# EAGLE design guhPLC_V0.2 (EAGLE 6.1)
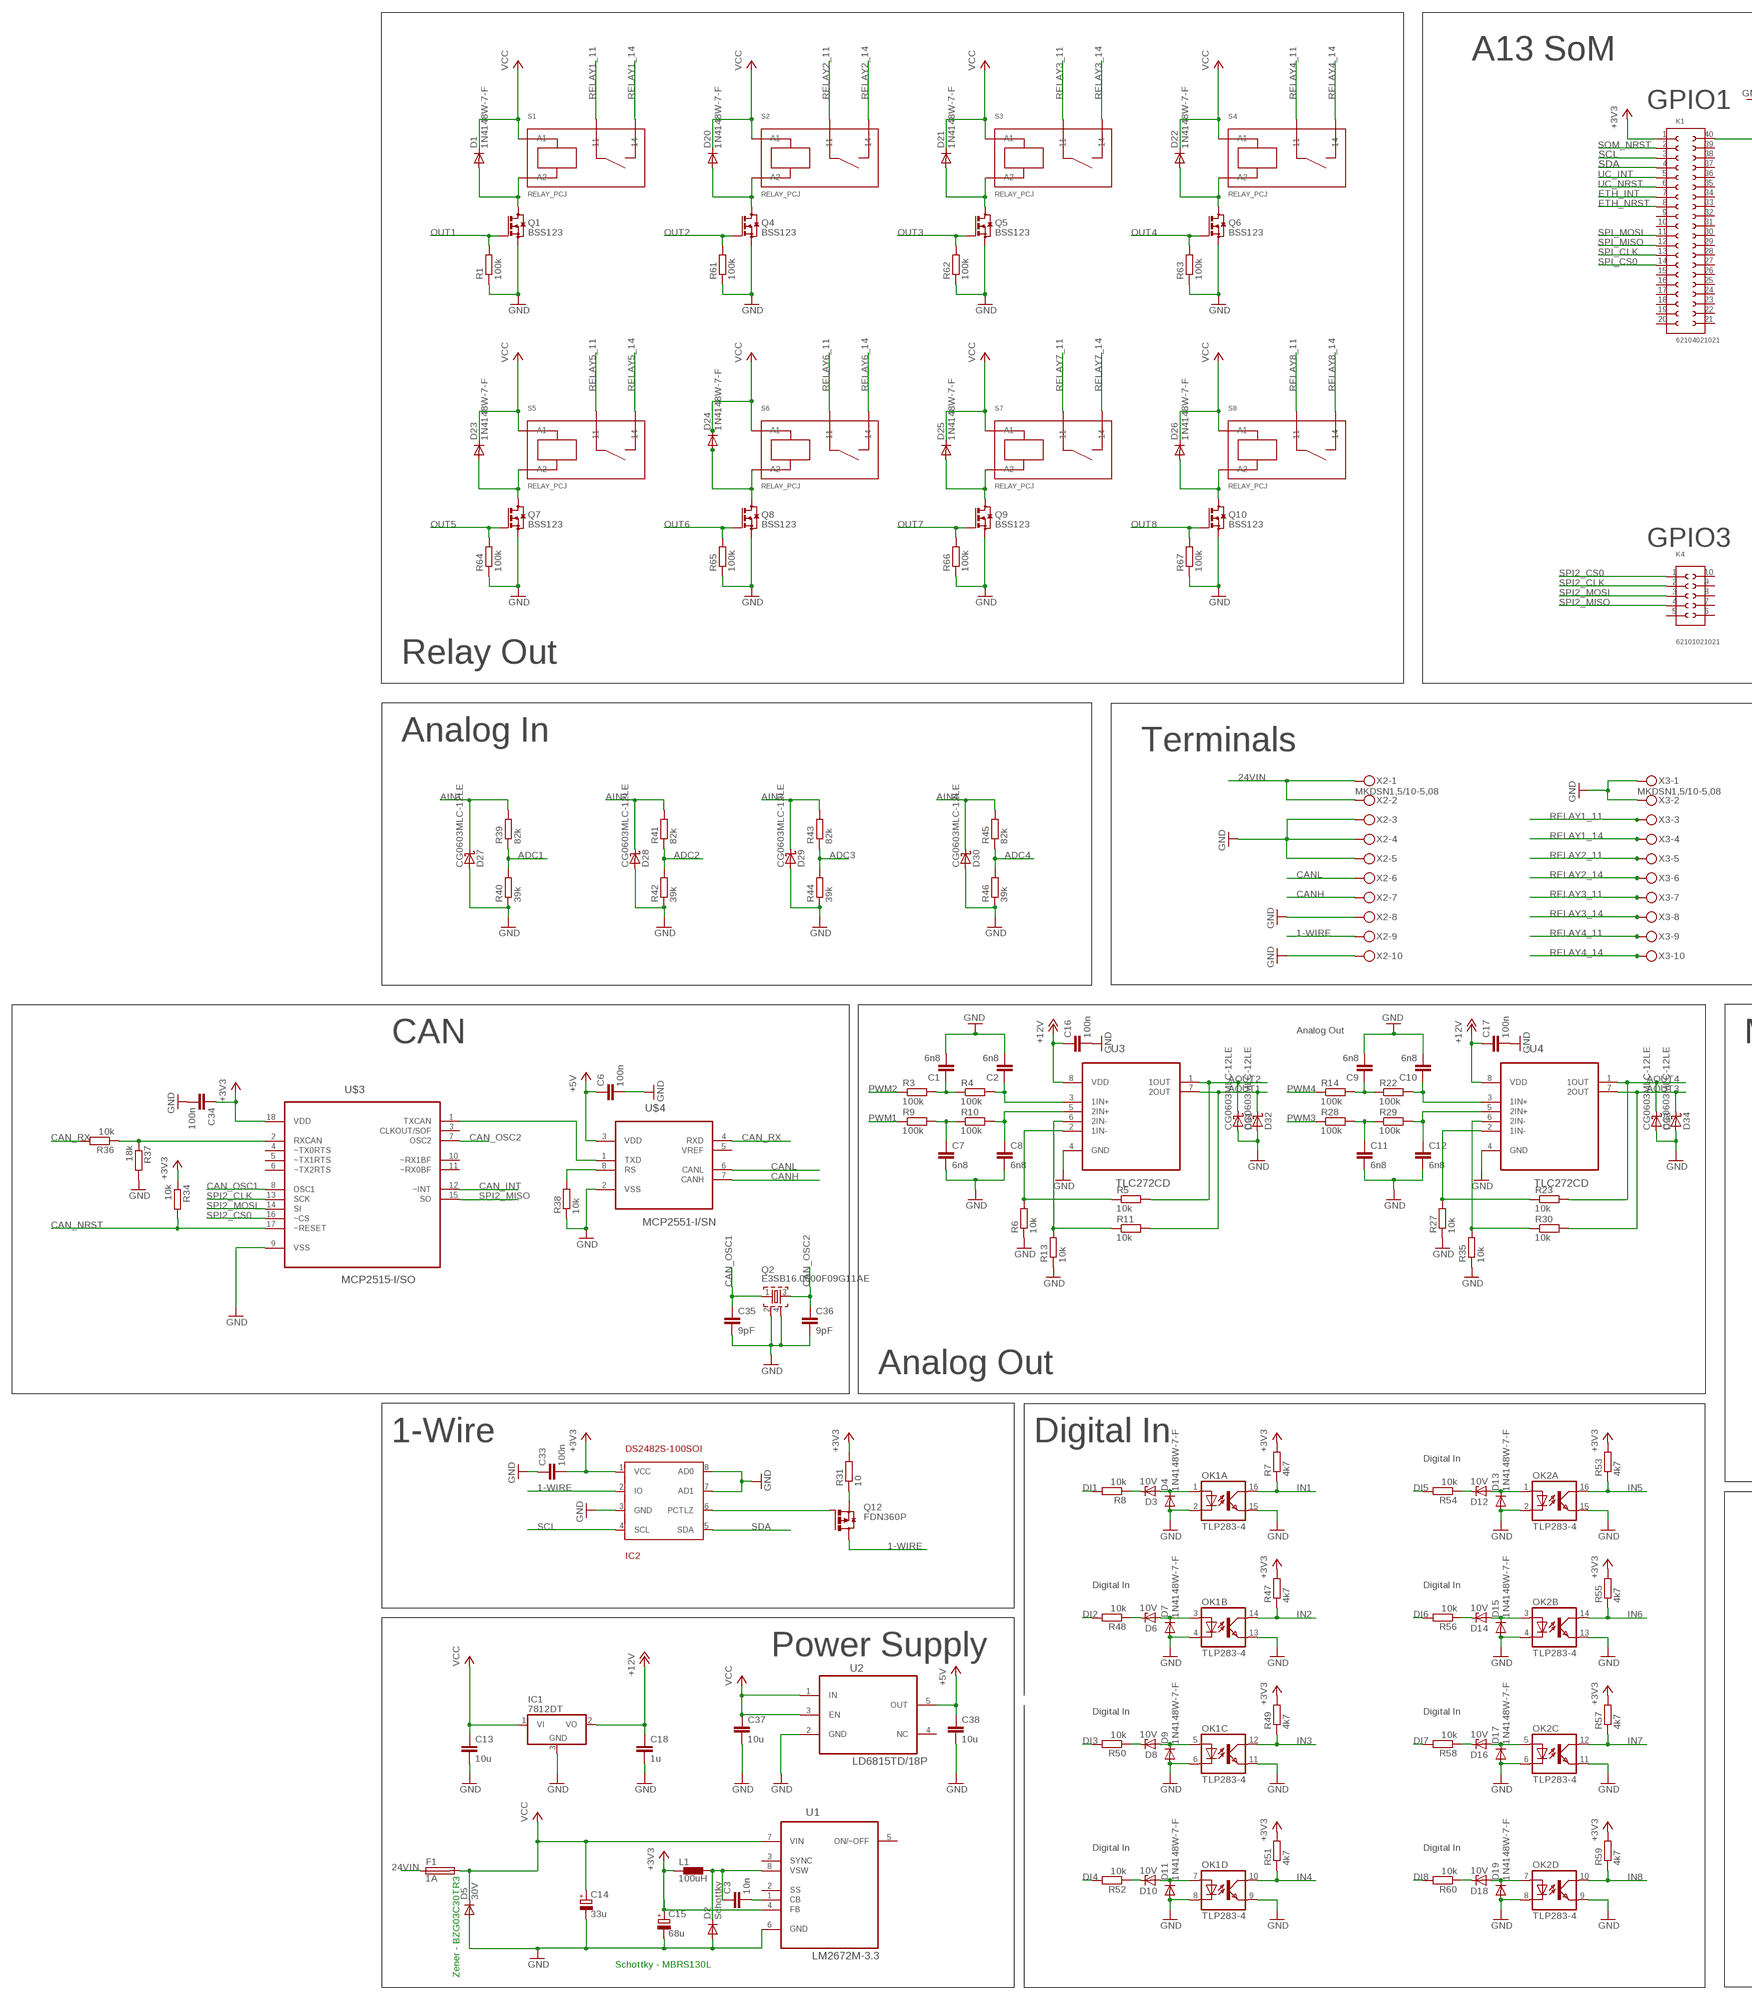
[diagram p0: schematic, sheet 1, part 1 of 2]
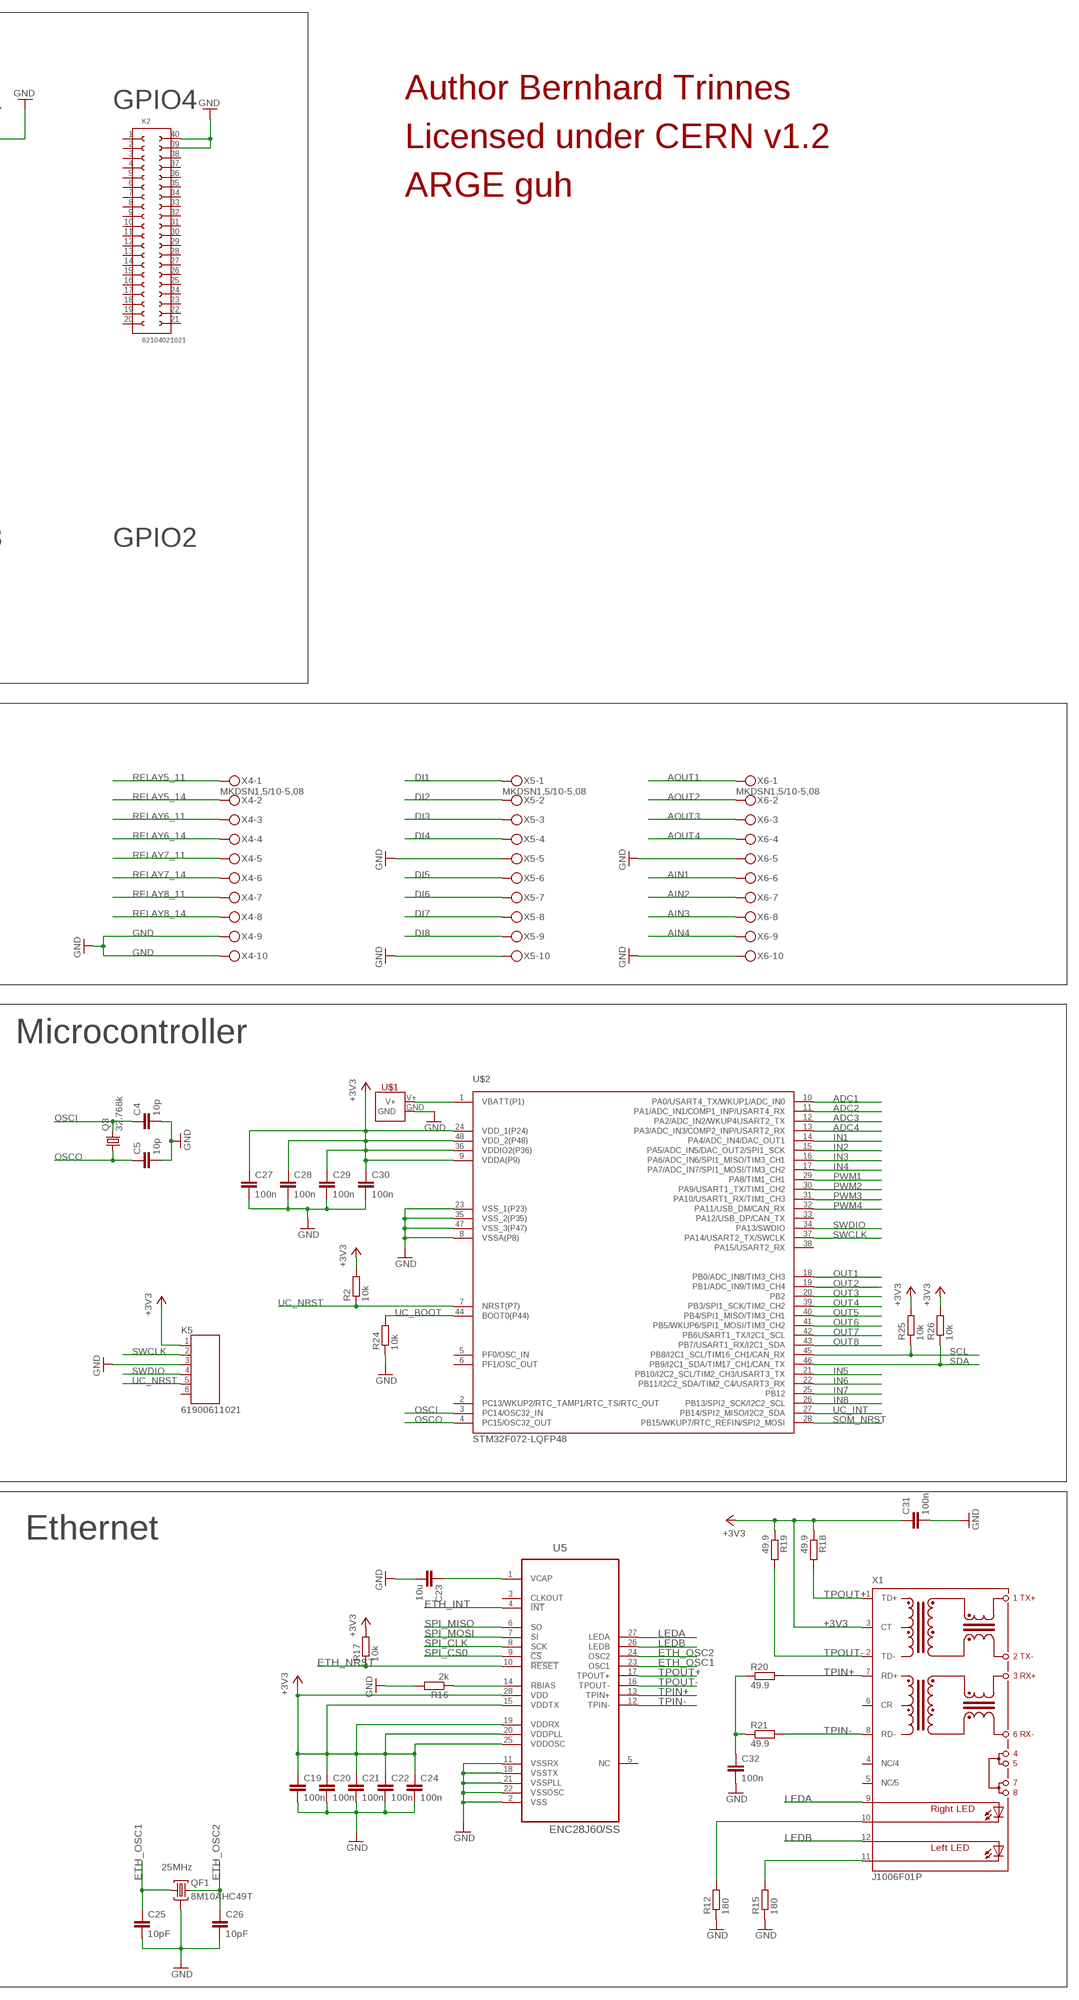
[diagram p1: schematic, sheet 1, part 2 of 2]

## Parts
C1  6n8  C-EUC0603  [C0603]
C2  6n8  C-EUC0603  [C0603]
C3  10n  C-EUC0603  [C0603]
C4  10p  C-EUC0603  [C0603]
C5  10p  C-EUC0603  [C0603]
C6  100n  C-EUC0603  [C0603]
C7  6n8  C-EUC0603  [C0603]
C8  6n8  C-EUC0603  [C0603]
C9  6n8  C-EUC0603  [C0603]
C10  6n8  C-EUC0603  [C0603]
C11  6n8  C-EUC0603  [C0603]
C12  6n8  C-EUC0603  [C0603]
C13  10u  C-EUC1206  [C1206]
C14  33u  CPOL-EUCT7343  [CT7343]
C15  68u  CPOL-EUCT6032  [CT6032]
C16  100n  C-EUC0603  [C0603]
C17  100n  C-EUC0603  [C0603]
C18  1u  C-EUC1206  [C1206]
C19  100n  C-EUC0603  [C0603]
C20  100n  C-EUC0603  [C0603]
C21  100n  C-EUC0603  [C0603]
C22  100n  C-EUC0603  [C0603]
C23  10u  C-EUC0603  [C0603]
C24  100n  C-EUC0603  [C0603]
C25  10pF  C-EUC0603  [C0603]
C26  10pF  C-EUC0603  [C0603]
C27  100n  C-EUC0603  [C0603]
C28  100n  C-EUC0603  [C0603]
C29  100n  C-EUC0603  [C0603]
C30  100n  C-EUC0603  [C0603]
C31  100n  C-EUC0603  [C0603]
C32  100n  C-EUC0402  [C0402]
C33  100n  C-EUC0603  [C0603]
C34  100n  C-EUC0603  [C0603]
C35  9pF  C-EUC0603  [C0603]
C36  9pF  C-EUC0603  [C0603]
C37  10u  C-EUC1206  [C1206]
C38  10u  C-EUC1206  [C1206]
D1  1N4148W-7-F  [SOD123]
D2  Schottky  DIODE-DO214AA  [DO214AA]
D3  10V  ZENER-DIODESOD80C  [SOD80C]
D4  1N4148W-7-F  [SOD123]
D5  30V  DIODE-DO214AC  [DO214AC]
D6  10V  ZENER-DIODESOD80C  [SOD80C]
D7  1N4148W-7-F  [SOD123]
D8  10V  ZENER-DIODESOD80C  [SOD80C]
D9  1N4148W-7-F  [SOD123]
D10  10V  ZENER-DIODESOD80C  [SOD80C]
D11  1N4148W-7-F  [SOD123]
D12  10V  ZENER-DIODESOD80C  [SOD80C]
D13  1N4148W-7-F  [SOD123]
D14  10V  ZENER-DIODESOD80C  [SOD80C]
D15  1N4148W-7-F  [SOD123]
D16  10V  ZENER-DIODESOD80C  [SOD80C]
D17  1N4148W-7-F  [SOD123]
D18  10V  ZENER-DIODESOD80C  [SOD80C]
D19  1N4148W-7-F  [SOD123]
D20  1N4148W-7-F  [SOD123]
D21  1N4148W-7-F  [SOD123]
D22  1N4148W-7-F  [SOD123]
D23  1N4148W-7-F  [SOD123]
D24  1N4148W-7-F  [SOD123]
D25  1N4148W-7-F  [SOD123]
D26  1N4148W-7-F  [SOD123]
D27  CG0603MLC-12LE  [R0603]
D28  CG0603MLC-12LE  [R0603]
D29  CG0603MLC-12LE  [R0603]
D30  CG0603MLC-12LE  [R0603]
D31  CG0603MLC-12LE  [R0603]
D32  CG0603MLC-12LE  [R0603]
D33  CG0603MLC-12LE  [R0603]
D34  CG0603MLC-12LE  [R0603]
F1  1A  LITTLEFUSE  [LITTLEFUSE]
IC1  7812DT  [TO252]
IC2  DS2482S-100SOI  [SOIC127P600X175-8N]
K1  62104021021  [62104021021]
K2  62104021021  [62104021021]
K4  62101021021  [62101021021]
K5  61900611021  [61900611021]
L1  100uH  DR1030  [DR1030]
OK1  TLP283-4  [MINI-FLAT-16]
OK2  TLP283-4  [MINI-FLAT-16]
Q1  BSS123  [SOT23]
Q2  E3SB16.0000F09G11AE  [E3SBXXXXXXXF09G11AE]
Q3  32.768k  CRYSTALTC26H  [TC26H]
Q4  BSS123  [SOT23]
Q5  BSS123  [SOT23]
Q6  BSS123  [SOT23]
Q7  BSS123  [SOT23]
Q8  BSS123  [SOT23]
Q9  BSS123  [SOT23]
Q10  BSS123  [SOT23]
Q12  FDN360P  [SUPER-SOT3]
QF1  8M10AHC49T  [HC49U]
R1  100k  R-EU_R0603  [R0603]
R2  10k  R-EU_R0603  [R0603]
R3  100k  R-EU_R0603  [R0603]
R4  100k  R-EU_R0603  [R0603]
R5  10k  R-EU_R0805  [R0805]
R6  10k  R-EU_R0805  [R0805]
R7  4k7  R-EU_R0603  [R0603]
R8  10k  R-EU_R0805  [R0805]
R9  100k  R-EU_R0603  [R0603]
R10  100k  R-EU_R0603  [R0603]
R11  10k  R-EU_R0805  [R0805]
R12  180  R-EU_R0603  [R0603]
R13  10k  R-EU_R0805  [R0805]
R14  100k  R-EU_R0603  [R0603]
R15  180  R-EU_R0603  [R0603]
R16  2k  R-EU_R0603  [R0603]
R17  10k  R-EU_R0603  [R0603]
R18  49.9  R-EU_R0603  [R0603]
R19  49.9  R-EU_R0603  [R0603]
R20  49.9  R-EU_R0603  [R0603]
R21  49.9  R-EU_R0603  [R0603]
R22  100k  R-EU_R0603  [R0603]
R23  10k  R-EU_R0805  [R0805]
R24  10k  R-EU_R0603  [R0603]
R25  10k  R-EU_R0603  [R0603]
R26  10k  R-EU_R0603  [R0603]
R27  10k  R-EU_R0805  [R0805]
R28  100k  R-EU_R0603  [R0603]
R29  100k  R-EU_R0603  [R0603]
R30  10k  R-EU_R0805  [R0805]
R31  10  R-EU_R0805  [R0805]
R34  10k  R-EU_R0603  [R0603]
R35  10k  R-EU_R0805  [R0805]
R36  10k  R-EU_R0603  [R0603]
R37  18k  R-EU_R0603  [R0603]
R38  10k  R-EU_R0603  [R0603]
R39  82k  R-EU_R0805  [R0805]
R40  39k  R-EU_R0805  [R0805]
R41  82k  R-EU_R0805  [R0805]
R42  39k  R-EU_R0805  [R0805]
R43  82k  R-EU_R0805  [R0805]
R44  39k  R-EU_R0805  [R0805]
R45  82k  R-EU_R0805  [R0805]
R46  39k  R-EU_R0805  [R0805]
R47  4k7  R-EU_R0603  [R0603]
R48  10k  R-EU_R0805  [R0805]
R49  4k7  R-EU_R0603  [R0603]
R50  10k  R-EU_R0805  [R0805]
R51  4k7  R-EU_R0603  [R0603]
R52  10k  R-EU_R0805  [R0805]
R53  4k7  R-EU_R0603  [R0603]
R54  10k  R-EU_R0805  [R0805]
R55  4k7  R-EU_R0603  [R0603]
R56  10k  R-EU_R0805  [R0805]
R57  4k7  R-EU_R0603  [R0603]
R58  10k  R-EU_R0805  [R0805]
R59  4k7  R-EU_R0603  [R0603]
R60  10k  R-EU_R0805  [R0805]
R61  100k  R-EU_R0603  [R0603]
R62  100k  R-EU_R0603  [R0603]
R63  100k  R-EU_R0603  [R0603]
R64  100k  R-EU_R0603  [R0603]
R65  100k  R-EU_R0603  [R0603]
R66  100k  R-EU_R0603  [R0603]
R67  100k  R-EU_R0603  [R0603]
S1  RELAY_PCJ  [RELAY_PCJ]
S2  RELAY_PCJ  [RELAY_PCJ]
S3  RELAY_PCJ  [RELAY_PCJ]
S4  RELAY_PCJ  [RELAY_PCJ]
S5  RELAY_PCJ  [RELAY_PCJ]
S6  RELAY_PCJ  [RELAY_PCJ]
S7  RELAY_PCJ  [RELAY_PCJ]
S8  RELAY_PCJ  [RELAY_PCJ]
U1  LM2672M-3.3  [SOIC127P600X175-8N]
U2  LD6815TD/18P  [SOT95P275X110-5N]
U3  TLC272CD  [SOIC127P600X175-8N]
U4  TLC272CD  [SOIC127P600X175-8N]
U5  ENC28J60/SS  [SOP65P780X200-28N]
U$1  MULTICOMP-CH7410-2032LF  [MULTICOMP-CH7410-2032LF]
U$2  STM32F072-LQFP48  [LQFP48]
U$3  MCP2515-I/SO  [SOIC127P1034X264-18N]
U$4  MCP2551-I/SN  [SOIC127P600X175-8N]
X1  J1006F01P  [J1]
X2  MKDSN1,5/10-5,08  [MKDSN1,5/10-5,08]
X3  MKDSN1,5/10-5,08  [MKDSN1,5/10-5,08]
X4  MKDSN1,5/10-5,08  [MKDSN1,5/10-5,08]
X5  MKDSN1,5/10-5,08  [MKDSN1,5/10-5,08]
X6  MKDSN1,5/10-5,08  [MKDSN1,5/10-5,08]

## Nets
1-WIRE: IC2.2(IO) Q12.3(D) X2.9
24VIN: F1.1 X2.1 X2.2
+3V3: C15.+ C19.1 C20.1 C21.1 C22.1 C24.1 C27.1 C28.1 C29.1 C30.1 C31.1 C33.2 C34.1 IC2.1(VCC) K1.1 K5.1 L1.1 R2.2 R7.2 R17.2 R18.1 R19.1 R25.2 R26.2 R31.2 R34.1 R47.2 R49.2 R51.2 R53.2 R55.2 R57.2 R59.2 U1.4(FB) U5.15(VDDTX) U5.19(VDDRX) U5.20(VDDPLL) U5.25(VDDOSC) U5.28(VDD) U$2.9(VDDA(P9)) U$2.24(VDD_1(P24)) U$2.36(VDDIO2(P36)) U$2.48(VDD_2(P48)) U$3.18(VDD) X1.3(CT)
+5V: C6.1 C38.1 U2.5(OUT) U$4.3(VDD)
+12V: C16.1 C17.1 C18.1 IC1.2(VO) U3.8(VDD) U4.8(VDD)
ADC1: R39.1 R40.2 U$2.10(PA0/USART4_TX/WKUP1/ADC_IN0)
ADC2: R41.1 R42.2 U$2.11(PA1/ADC_IN1/COMP1_INP/USART4_RX)
ADC3: R43.1 R44.2 U$2.12(PA2/ADC_IN2/WKUP4USART2_TX)
ADC4: R45.1 R46.2 U$2.13(PA3/ADC_IN3/COMP2_INP/USART2_RX)
AIN1: D27.2(C) R39.2 X6.6
AIN2: D28.2(C) R41.2 X6.7
AIN3: D29.2(C) R43.2 X6.8
AIN4: D30.2(C) R45.2 X6.9
AOUT1: D32.2(C) R11.2 U3.7(2OUT) X6.1
AOUT2: D31.2(C) R5.2 U3.1(1OUT) X6.2
AOUT3: D34.2(C) R30.2 U4.7(2OUT) X6.3
AOUT4: D33.2(C) R23.2 U4.1(1OUT) X6.4
CAN_INT: U$3.12(~INT)
CAN_NRST: R34.2 U$3.17(~RESET)
CAN_OSC1: C35.1 Q2.1 U$3.8(OSC1)
CAN_OSC2: C36.1 Q2.3 U$3.7(OSC2)
CAN_RX: R36.2 U$4.4(RXD)
CANH: U$4.7(CANH) X2.7
CANL: U$4.6(CANL) X2.6
DI1: R8.2 X5.1
DI2: R48.2 X5.2
DI3: R50.2 X5.3
DI4: R52.2 X5.4
DI5: R54.2 X5.6
DI6: R56.2 X5.7
DI7: R58.2 X5.8
DI8: R60.2 X5.9
ETH_INT: K1.7 U5.4(!INT)
ETH_NRST: K1.8 R17.1 U5.10(!RESET)
ETH_OSC1: C25.1 QF1.1 U5.23(OSC1)
ETH_OSC2: C26.1 QF1.3 U5.24(OSC2)
GND [gnd]: C1.2 C2.2 C4.2 C5.2 C6.2 C7.2 C8.2 C9.2 C10.2 C11.2 C12.2 C13.2 C14.- C15.- C16.2 C17.2 C18.2 C19.2 C20.2 C21.2 C22.2 C23.2 C24.2 C25.2 C26.2 C27.2 C28.2 C29.2 C30.2 C31.2 C32.2 C33.1 C34.2 C35.2 C36.2 C37.2 C38.2 D2.A D4.A D5.A D7.A D9.A D11.A D13.A D15.A D17.A D19.A D27.1(A) D28.1(A) D29.1(A) D30.1(A) D31.1(A) D32.1(A) D33.1(A) D34.1(A) IC1.3(GND) IC2.3(GND) IC2.7(AD1) IC2.8(AD0) K1.40 K2.39 K2.40 K5.3 OK1.2(A:C) OK1.4(B:C) OK1.6(C:C) OK1.8(D:C) OK1.9(D:EMIT) OK1.11(C:EMIT) OK1.13(B:EMIT) OK1.15(A:EMIT) OK2.2(A:C) OK2.4(B:C) OK2.6(C:C) OK2.8(D:C) OK2.9(D:EMIT) OK2.11(C:EMIT) OK2.13(B:EMIT) OK2.15(A:EMIT) Q1.2(S) Q2.2 Q2.4 Q4.2(S) Q5.2(S) Q6.2(S) Q7.2(S) Q8.2(S) Q9.2(S) Q10.2(S) QF1.2 R1.1 R6.1 R12.1 R13.1 R15.1 R16.2 R24.1 R27.1 R35.1 R37.2 R38.1 R40.1 R42.1 R44.1 R46.1 R61.1 R62.1 R63.1 R64.1 R65.1 R66.1 R67.1 U1.6(GND) U2.2(GND) U3.4(GND) U4.4(GND) U5.2(VSS) U5.11(VSSRX) U5.18(VSSTX) U5.21(VSSPLL) U5.22(VSSOSC) U$1.GND U$2.8(VSSA(P8)) U$2.23(VSS_1(P23)) U$2.35(VSS_2(P35)) U$2.47(VSS_3(P47)) U$3.9(VSS) U$4.2(VSS) X2.3 X2.4 X2.5 X2.8 X2.10 X3.1 X3.2 X4.9 X4.10 X5.5 X5.10 X6.5 X6.10
IN1: OK1.16(A:COL) R7.1 U$2.14(PA4/ADC_IN4/DAC_OUT1)
IN2: OK1.14(B:COL) R47.1 U$2.15(PA5/ADC_IN5/DAC_OUT2/SPI1_SCK)
IN3: OK1.12(C:COL) R49.1 U$2.16(PA6/ADC_IN6/SPI1_MISO/TIM3_CH1)
IN4: OK1.10(D:COL) R51.1 U$2.17(PA7/ADC_IN7/SPI1_MOSI/TIM3_CH2)
IN5: OK2.16(A:COL) R53.1 U$2.21(PB10/I2C2_SCL/TIM2_CH3/USART3_TX)
IN6: OK2.14(B:COL) R55.1 U$2.22(PB11/I2C2_SDA/TIM2_C4/USART3_RX)
IN7: OK2.12(C:COL) R57.1 U$2.25(PB12)
IN8: OK2.10(D:COL) R59.1 U$2.26(PB13/SPI2_SCK/I2C2_SCL)
LEDA: U5.27(LEDA) X1.9(A-R)
LEDB: U5.26(LEDB) X1.12(A-L)
N$1: C3.2 U1.1(CB)
N$2: IC2.6(PCTLZ) Q12.1(G)
N$3: U$1.V+ U$2.1(VBATT(P1))
N$4: D1.A Q1.3(D) S1.A2
N$5: C7.1 R9.2 R10.1
N$6: C1.1 R3.2 R4.1
N$7: C2.1 R4.2 U3.3(1IN+)
N$8: D3.C R8.1
N$9: R5.1 R6.2 U3.2(1IN-)
N$10: D3.A D4.C OK1.1(A:A)
N$11: C8.1 R10.2 U3.5(2IN+)
N$12: D24.A Q8.3(D) S6.A2
N$13: C9.1 R14.2 R22.1
N$14: C10.1 R22.2 U4.3(1IN+)
N$15: R23.1 R27.2 U4.2(1IN-)
N$16: C3.1 D2.C L1.2 U1.8(VSW)
N$17: C11.1 R28.2 R29.1
N$18: C12.1 R29.2 U4.5(2IN+)
N$19: Q12.2(S) R31.1
N$20: U$3.1(TXCAN) U$4.1(TXD)
N$21: D6.C R48.1
N$22: R36.1 R37.1 U$3.2(RXCAN)
N$23: D6.A D7.C OK1.3(B:A)
N$24: R38.2 U$4.8(RS)
N$26: C32.1 R20.1 R21.1
N$28: C23.1 U5.1(VCAP)
N$29: R12.2 X1.10(C-R)
N$30: R15.2 X1.11(C-L)
N$32: R11.1 R13.2 U3.6(2IN-)
N$33: R30.1 R35.2 U4.6(2IN-)
N$38: D8.C R50.1
N$39: D8.A D9.C OK1.5(C:A)
N$40: D10.C R52.1
N$41: D10.A D11.C OK1.7(D:A)
N$42: D12.C R54.1
N$43: R16.1 U5.14(RBIAS)
N$45: D12.A D13.C OK2.1(A:A)
N$47: D14.C R56.1
N$49: D14.A D15.C OK2.3(B:A)
N$51: D16.C R58.1
N$53: D16.A D17.C OK2.5(C:A)
N$54: D18.C R60.1
N$55: D18.A D19.C OK2.7(D:A)
N$56: D20.A Q4.3(D) S2.A2
N$57: D21.A Q5.3(D) S3.A2
N$58: D22.A Q6.3(D) S4.A2
N$59: D23.A Q7.3(D) S5.A2
N$61: D25.A Q9.3(D) S7.A2
N$62: D26.A Q10.3(D) S8.A2
OSCI: C4.1 Q3.2 U$2.3(PC14/OSC32_IN)
OSCO: C5.1 Q3.1 U$2.4(PC15/OSC32_OUT)
OUT1: Q1.1(G) R1.2 U$2.18(PB0/ADC_IN8/TIM3_CH3)
OUT2: Q4.1(G) R61.2 U$2.19(PB1/ADC_IN9/TIM3_CH4)
OUT3: Q5.1(G) R62.2 U$2.20(PB2)
OUT4: Q6.1(G) R63.2 U$2.39(PB3/SPI1_SCK/TIM2_CH2)
OUT5: Q7.1(G) R64.2 U$2.40(PB4/SPI1_MISO/TIM3_CH1)
OUT6: Q8.1(G) R65.2 U$2.41(PB5/WKUP6/SPI1_MOSI/TIM3_CH2)
OUT7: Q9.1(G) R66.2 U$2.42(PB6USART1_TX/I2C1_SCL)
OUT8: Q10.1(G) R67.2 U$2.43(PB7/USART1_RX/I2C1_SDA)
PWM1: R9.1 U$2.29(PA8/TIM1_CH1)
PWM2: R3.1 U$2.30(PA9/USART1_TX/TIM1_CH2)
PWM3: R28.1 U$2.31(PA10/USART1_RX/TIM1_CH3)
PWM4: R14.1 U$2.32(PA11/USB_DM/CAN_RX)
RELAY1_11: S1.11 X3.3
RELAY1_14: S1.14 X3.4
RELAY2_11: S2.11 X3.5
RELAY2_14: S2.14 X3.6
RELAY3_11: S3.11 X3.7
RELAY3_14: S3.14 X3.8
RELAY4_11: S4.11 X3.9
RELAY4_14: S4.14 X3.10
RELAY5_11: S5.11 X4.1
RELAY5_14: S5.14 X4.2
RELAY6_11: S6.11 X4.3
RELAY6_14: S6.14 X4.4
RELAY7_11: S7.11 X4.5
RELAY7_14: S7.14 X4.6
RELAY8_11: S8.11 X4.7
RELAY8_14: S8.14 X4.8
SCL: IC2.4(SCL) K1.3 R25.1 U$2.45(PB8/I2C1_SCL/TIM16_CH1/CAN_RX)
SDA: IC2.5(SDA) K1.4 R26.1 U$2.46(PB9/I2C1_SDA/TIM17_CH1/CAN_TX)
SOM_NRST: K1.2 U$2.28(PB15/WKUP7/RTC_REFIN/SPI2_MOSI)
SPI2_CLK: K4.2 U$3.13(SCK)
SPI2_CS0: K4.1 U$3.16(~CS)
SPI2_MISO: K4.4 U$3.15(SO)
SPI2_MOSI: K4.3 U$3.14(SI)
SPI_CLK: K1.13 U5.8(SCK)
SPI_CS0: K1.14 U5.9(!CS)
SPI_MISO: K1.12 U5.6(SO)
SPI_MOSI: K1.11 U5.7(SI)
SWCLK: K5.2 U$2.37(PA14/USART2_TX/SWCLK)
SWDIO: K5.4 U$2.34(PA13/SWDIO)
TPIN+: R20.2 U5.13(TPIN+) X1.7(RD+)
TPIN-: R21.2 U5.12(TPIN-) X1.8(RD-)
TPOUT+: R18.2 U5.17(TPOUT+) X1.1(TD+)
TPOUT-: R19.2 U5.16(TPOUT-) X1.2(TD-)
UC_BOOT: R24.2 U$2.44(BOOT0(P44))
UC_INT: K1.5 U$2.27(PB14/SPI2_MISO/I2C2_SDA)
UC_NRST: K1.6 K5.5 R2.1 U$2.7(NRST(P7))
VCC [power]: C13.1 C14.+ C37.1 D1.C D5.C D20.C D21.C D22.C D23.C D24.C D25.C D26.C F1.2 IC1.1(VI) S1.A1 S2.A1 S3.A1 S4.A1 S5.A1 S6.A1 S7.A1 S8.A1 U1.7(VIN) U2.1(IN) U2.3(EN)
Unconnected: K1.9 K1.10 K1.15 K1.16 K1.17 K1.18 K1.19 K1.20 K1.21 K1.22 K1.23 K1.24 K1.25 K1.26 K1.27 K1.28 K1.29 K1.30 K1.31 K1.32 K1.33 K1.34 K1.35 K1.36 K1.37 K1.38 K1.39 K2.1 K2.2 K2.3 K2.4 K2.5 K2.6 K2.7 K2.8 K2.9 K2.10 K2.11 K2.12 K2.13 K2.14 K2.15 K2.16 K2.17 K2.18 K2.19 K2.20 K2.21 K2.22 K2.23 K2.24 K2.25 K2.26 K2.27 K2.28 K2.29 K2.30 K2.31 K2.32 K2.33 K2.34 K2.35 K2.36 K2.37 K2.38 K4.5 K4.6 K4.7 K4.8 K4.9 K4.10 K5.6 U1.2(SS) U1.3(SYNC) U1.5(ON/~OFF) U2.4(NC) U5.3(CLKOUT) U5.5(NC) U$2.2(PC13/WKUP2/RTC_TAMP1/RTC_TS/RTC_OUT) U$2.5(PF0/OSC_IN) U$2.6(PF1/OSC_OUT) U$2.33(PA12/USB_DP/CAN_TX) U$2.38(PA15/USART2_RX) U$3.3(CLKOUT/SOF) U$3.4(~TX0RTS) U$3.5(~TX1RTS) U$3.6(~TX2RTS) U$3.10(~RX1BF) U$3.11(~RX0BF) U$4.5(VREF) X1.4(NC/4) X1.5(NC/5) X1.6(CR)

## Notes on the sheet
- A13 SoM
- Author Bernhard Trinnes
- GPIO1 | GPIO4
- Licensed under CERN v1.2
- ARGE guh
- GPIO3 | GPIO2
- Relay Out
- Analog In | Terminals
- Analog Out
- CAN | Microcontroller
- Analog Out
- 1-Wire | Digital In
- Digital In
- Ethernet
- Digital In | Digital In
- Power Supply
- Digital In | Digital In
- Digital In | Digital In
- 25MHz
- Schottky - MBRS130L
- Zener - BZG03C30TR3

## Library data of the parts
C1-C13 C16-C38 = resistor:C-EU: CAPACITOR, European symbol
C14 C15 = rcl:CPOL-EU: POLARIZED CAPACITOR, European symbol
D1 D4 D7 D9 D11 D13 D15 D17 D19-D26 = guh:1N4148W-7-F: Fast Switching Speed • • Low Forward Voltage: Maximum of 0.715V at 1mA • • Fast Reverse Recovery: Maximum of 4ns • Low Capacitance: Maximum of 2pF • • Surface Mount Package Ideally Suited for Automated Insertion • • For General Purpose Switching Applications • Totally Lead-Free & Fully RoHS Compliant (Notes 1 & 2) • • Halogen and Antimony Free. “Green” Device (Note 3) • • Qualified to AEC-Q101 Standards for High Reliability
D2 D5 = diode:DIODE-: DIODE
D3 D6 D8 D10 D12 D14 D16 D18 = diode:ZENER-DIODE: Z-Diode
D27-D34 = guh:CG0603MLC-12LE: Anzahl der Pins: 2 Bauform: 0603 Begrenzungsspannung Vc, max.: 30V Betriebsspannung: 12V Verpackung: Gurtabschnitt Verlustleistung Pd: - SVHC: No SVHC (15-Jun-2015)
F1 = fuse:LITTLEFUSE: LITTLEFUSE Picofuse/slow Littlefuse; OC_FARNELL: unknown; OC_NEWARK: unknown
IC1 = linear:78*: Positive VOLTAGE REGULATOR Source: http://cache.national.com/ds/LM/LM78L05.pdf http://www.fairchildsemi.com/ds/LM/LM7805.pdf
IC2 = guh:DS2482S-100: The DS2482-100 is an I2C-to-1-Wire® bridge device that interfaces directly to standard (100kHz max) or fast (400kHz max) I2C masters to perform bidirectional pro- tocol conversion between the I2C master and any downstream 1-Wire slave devices. Relative to any attached 1-Wire slave device, the DS2482-100 is a 1-Wire master. Internal, factory-trimmed timers relieve the system host processor from generating time-critical 1-Wire waveforms, supporting both standard and over- drive 1-Wire communication speeds. To optimize 1-Wire waveform generation, the DS2482-100 performs slew-rate control on rising and falling 1-Wire edges and provides additional programmable features to match drive characteristics to the 1-Wire slave environment. Programmable, strong pullup features support 1-Wire power delivery to 1-Wire devices such as EEPROMs and sensors. The DS2482-100 combines these features with an output to control an external MOSFET for enhanced strong pullup application. The I2C slave address assignment is controlled by two binary address inputs, resolving potential conflicts with other I2C slave devices in the system.
K1 K2 = EagleLibrary_Wuerth_Elektronik_eiCan_Board_to_Board_Connectors_v6_20150113:62104021021: WR-PHD 1.27mm Dual SMT Pin Header H=3.80 mm, 40 Pins=>Code : Con_BTB_PHD_1.27_2_62104021021 <http://katalog.we-online.de/media/thumbs2/eican/thb_Con_BTB_PHD_1.27_2_6210xx21021_pf2.jpg> Details see: http://katalog.we-online.de/en/em/621_0xx_210_21 Created 2014-06-03, Karrer Zheng 2014 (C) Würth Elektronik
K4 = EagleLibrary_Wuerth_Elektronik_eiCan_Board_to_Board_Connectors_v6_20150113:62101021021: WR-PHD 1.27mm Dual SMT Pin Header H=3.80 mm, 10 Pins=>Code : Con_BTB_PHD_1.27_2_62101021021 <http://katalog.we-online.de/media/thumbs2/eican/thb_Con_BTB_PHD_1.27_2_6210xx21021_pf2.jpg> Details see: http://katalog.we-online.de/en/em/621_0xx_210_21 Created 2014-06-03, Karrer Zheng 2014 (C) Würth Elektronik
K5 = EagleLibrary_Wuerth_Elektronik _eiCan_Wire_to_Board_Connectors_v6_20150113:61900611021: WR-WTB Wire-to-Board Connectors 2.54 mm - 6 Pins;=>Code : _61900611021 <http://katalog.we-online.de/media/images/eican/> Details see: http://katalog.we-online.de/em/datasheet/6190xx11021.pdf Created 11/27/2014, Karrer Zheng 2014 (C) Wurth Elektronik
L1 = inductors:DR1030: DR1030 Series Low Profile Power Inductors Source: Data sheet <http://www.cooperbussmann.com/pdf/c73e479f-f867-4c64-ae26-9c1f23814163.pdf>
OK1 OK2 = optocoupler:TLP283-4: TOSHIBA PHOTOCOUPLER GaAs IRED & PHOTO-TRANSISTOR Source: http://www.semicon.toshiba.co.jp/td/en/Opto/Photocoupler/en_20050928_TLP283_datasheet.pdf; OC_FARNELL: unknown; OC_NEWARK: unknown
Q1 Q4-Q10 = transistor-small-signal:BSS123: N-CHANNEL MOS FET
Q2 = guh:E3SB16.0000F09G11AE: Holder Style Mode Adjustment Tolerance Temperature Stability Operating Temp. Range Load Capacitance ESR Static Capacitance (C0) Ageing Marking 3X25X06 4-Pad Fundamental As Required by CSR Chipset As Required by CSR Chipset -40°C to +85°C 9 pF 80 Max Ohm As Required by CSR Chipset As Required by CSR Chipset 16.000 / YWWX
Q3 = crystal:CRYSTAL: CRYSTAL; OC_FARNELL: unknown; OC_NEWARK: unknown
Q12 = transistor-power:FDN360P: Single P-Channel, PowerTrench (R) MOSFET Source: http://www.fairchildsemi.com/ds/FD/FDN360P.pdf
QF1 = crystal:8M10AHC49T: Monolithic Crystal Filters Source: www.vanlong.com; OC_FARNELL: unknown; OC_NEWARK: unknown
R1-R31 R34-R67 = resistor:R-EU_: RESISTOR, European symbol
S1-S8 = guh:RELAY_PCJ: 1pole 3A/5A, 1 form A (NO) contact n Sensitive coil 200mW n Ambient temperature 85°C n RoHS compliant (Directive 2002/95/EC) n WG version : Product in accordance to IEC60335-1
U1 = guh:LM2672M-3.3: Power converter; MPN: LM2672M-3.3; OC_FARNELL: 4466550; OC_NEWARK: 41K4080; PACKAGE: 8-SOIC; SUPPLIER: NationalSemiconductor
U2 = guh:LD6815TD/18P: LDO, 5.5V, 0.25VDO, 0.15A, 1.8V, 5TSOP; MPN: LD6815TD/18P; OC_FARNELL: 2308291; OC_NEWARK: 69W9564; PACKAGE: TSOP-5; SUPPLIER: NXP
U3 U4 = guh:TLC272CD: LinCMOS. PRECISION DUAL OPERATIONAL AMPLIFIERS; MPN: TLC272CD; OC_FARNELL: 1106022; OC_NEWARK: 67K1262; PACKAGE: SOIC-8; SUPPLIER: Texas Instruments
U5 = guh:ENC28J60/SS: ETHERNET CONTROLLER 8 KB RAM, 28J60,SSOP-28; MPN: ENC28J60/SS; OC_FARNELL: 1084620; OC_NEWARK: 31K1708; PACKAGE: SSOP-28; SUPPLIER: Microchip
U$1 = talons-power:MULTICOMP-CH7410-2032LF: MULTICOMP CH7410-2032LF BATTERIEHALTER, SMT, 20MM Octopart <https://octopart.com/ch7410-2032lf-multicomp-21274228> Farnell.de <http://de.farnell.com/multicomp/ch7410-2032lf/batteriehalter-smt-20mm/dp/2064724?CMP=i-bf9f-00001000>
U$2 = stm32f0:STM32F072
U$3 = guh:MCP2515-I/SO: CAN Controller; MPN: MCP2515-I/SO; OC_FARNELL: 1292239; OC_NEWARK: 29H7136; PACKAGE: SOIC-18; SUPPLIER: Microchip
U$4 = guh:MCP2551-I/SN: High-Speed CAN Transceiver; MPN: MCP2551-I/SN; OC_FARNELL: 9758569; OC_NEWARK: 69K7604; PACKAGE: SOIC-8; SUPPLIER: Microchip
X1 = con-pulse:J1006F01P: PULSEJACK (TM) 1x1 Tab-UP RJ45 10/100 Base-TX RJ45 1x1 Tab-UP with LEDs 8-pin (J1 series) and 6-pin (JP series) integrated magnetics connector, designed to support applications, such as ADSL modems, LAN-on-Motherboard, and Hub and Switches. Source: www.pulseeng.com .. PulseJack-J402.pdf; OC_FARNELL: unknown; OC_NEWARK: unknown
X2-X6 = con-phoenix-508:MKDSN1,5/10-5,08: MKDSN 1,5/10-5,08 Printklemme Nennstrom: 13,5 A Nennspannung: 250 V Rastermaß: 5,08 mm Polzahl: 10 Anschlussart: Schraubanschluss Montage: Löten Anschlussrichtung Leiter/Platine: 0 ° Artikelnummer: 1729209 Source: http://eshop.phoenixcontact.com .. 1729209.pdf; MPN: SMKDSN1,5/10-5,08; OC_FARNELL: 1792913; OC_NEWARK: 70R0297

## Net classes
0 default: width 0.254 mm, clearance 0.254 mm
1 power: width 0.61 mm, drill 0.61 mm, clearance 0.254 mm
2 gnd: width 0.305 mm, drill 0.559 mm, clearance 0.254 mm
3 usbvcc: width 0.508 mm, drill 0.61 mm, clearance 0.254 mm
4 aref: width 0.406 mm, drill 0.61 mm, clearance 0.254 mm

## Board
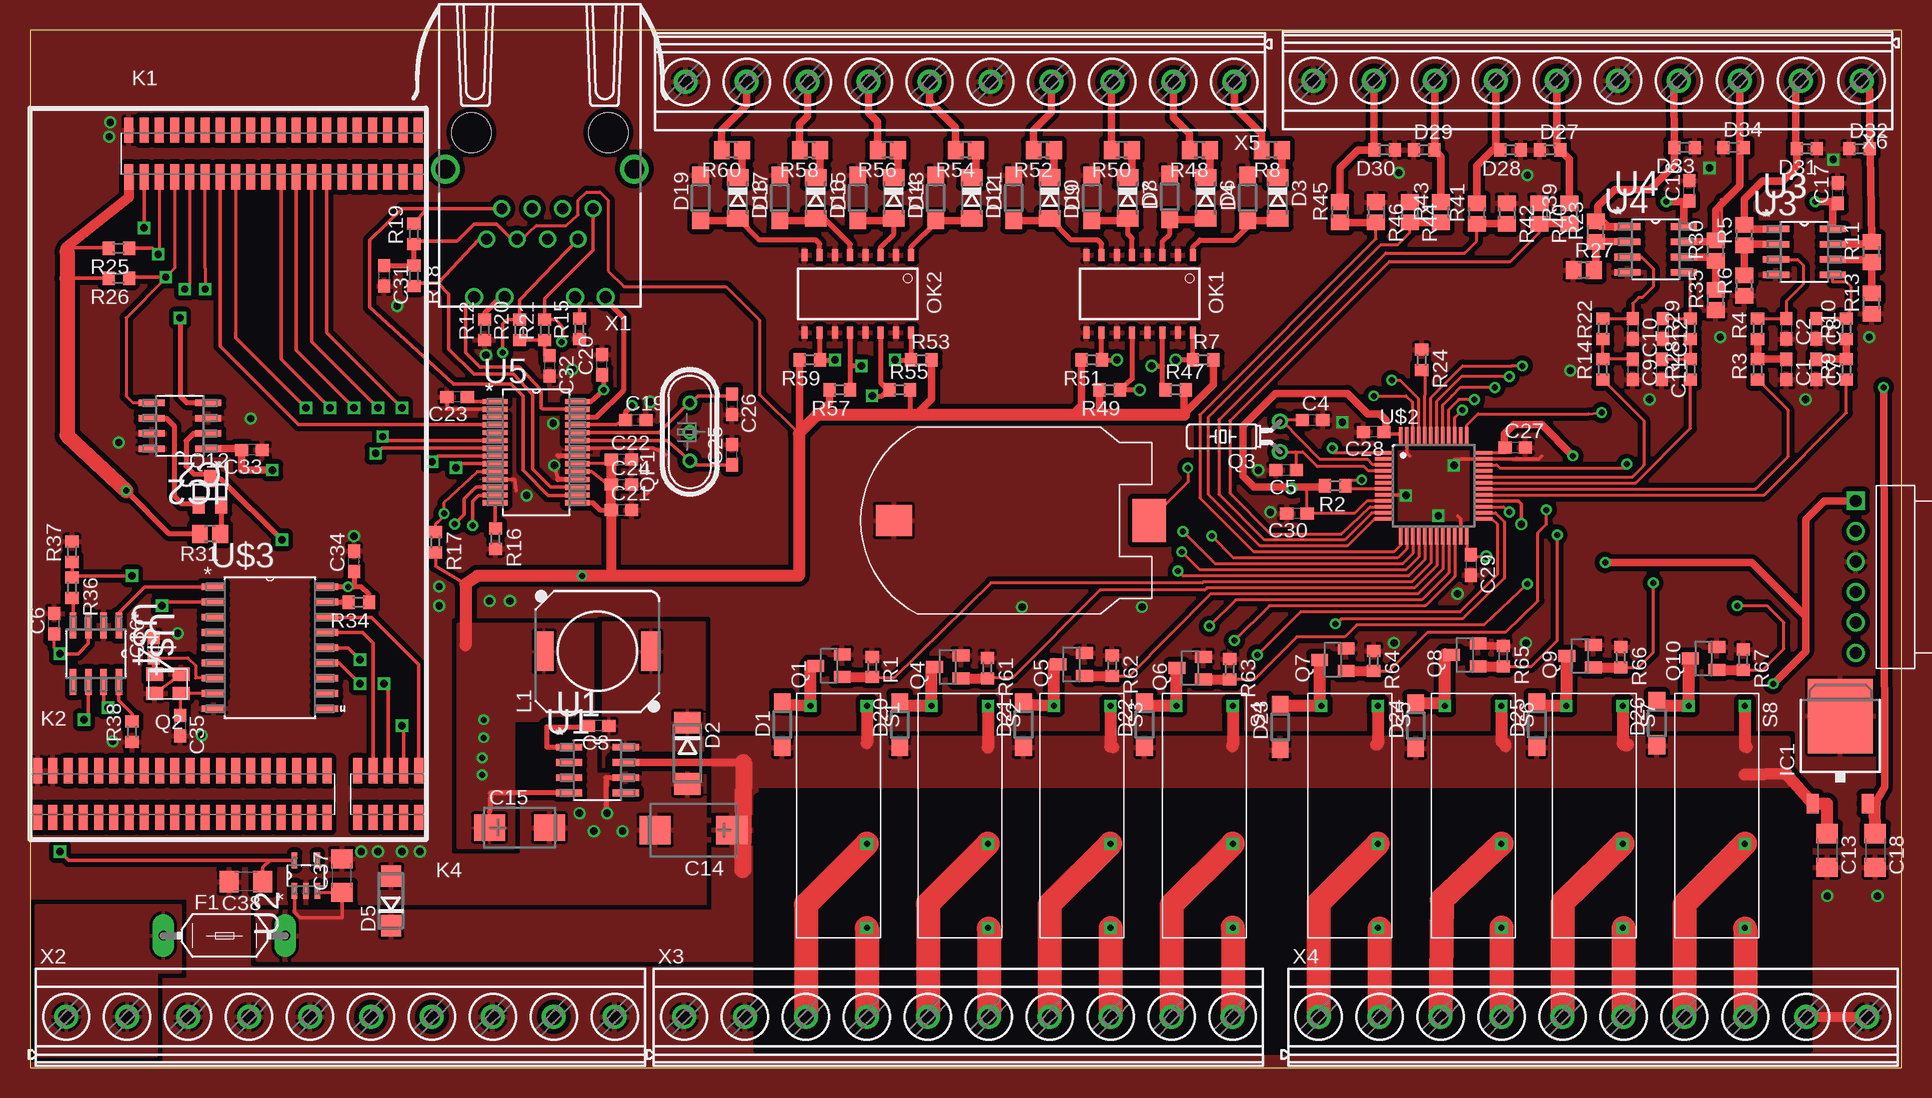
[diagram p2: board, top side]
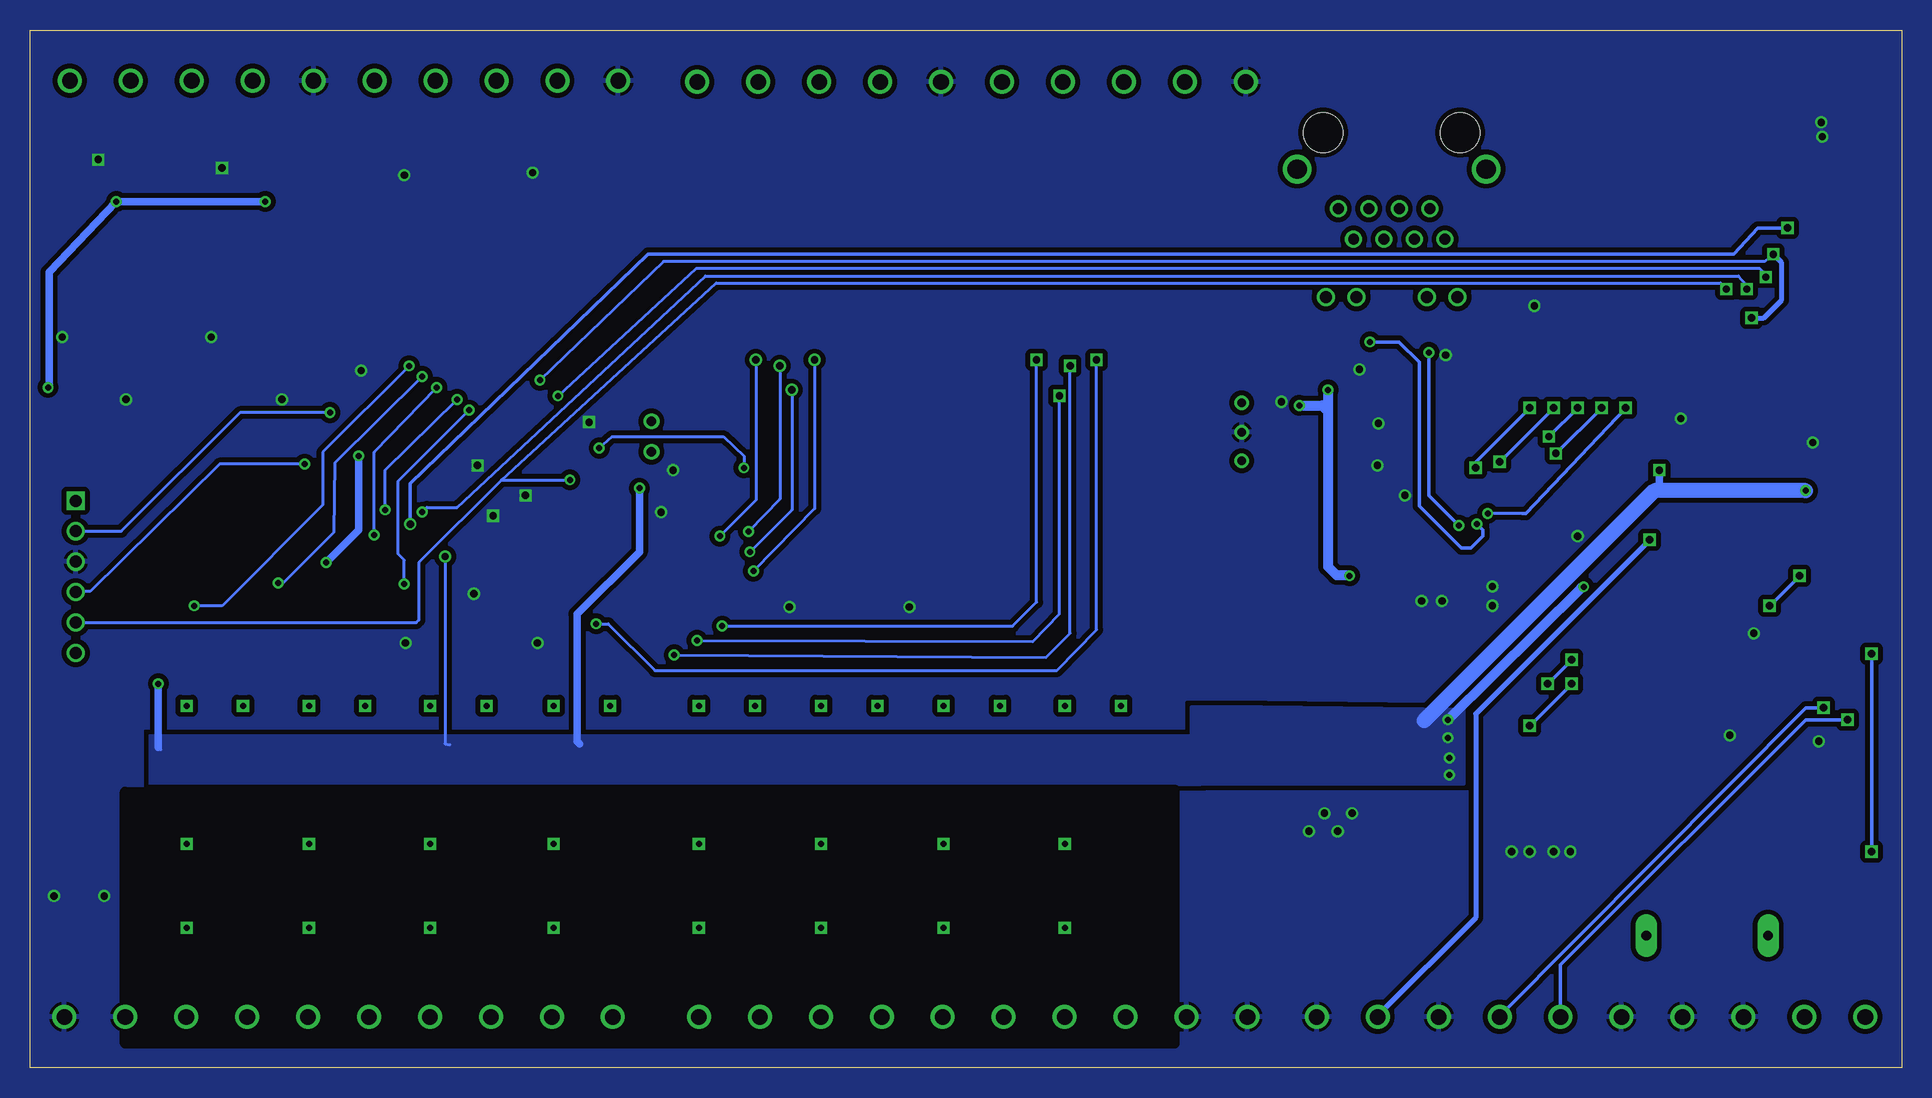
[diagram p3: board, bottom side, seen from below]

Size 156 x 86.5 mm. Coordinates in mm from the lower left corner, seen from the top.
Outline: 0,0 156,0 156,86.5 0,86.5 0,0
Copper layers (1*16): Top 0.035mm / dielectric 1.5mm / Bottom 0.035mm
Design rules: minimum track width 6mil, minimum drill 8mil, track to track 6mil, track to pad 6mil, pad to pad 6mil, via to via 8mil, smd to smd 6mil, copper to edge 0mil, drill to drill 8mil, minimum pad ring 10mil, minimum via ring 8mil, stop-mask expansion 4mil, vias tented up to drill 0mil, thermal gap 10mil
tRestrict: area 60.7,1.5 to 148.2,22.5
bRestrict: area 60.6,2 to 148.1,23

### Footprints (pad centres in the part's own frame; a part is rotated, then mirrored left to right if it is on the bottom)
C0603 = smd 1.1 x 1: 1 -0.85,0; 2 0.85,0
C1206 = smd 1.6 x 1.8: 1 -1.4,0; 2 1.4,0
CT7343 = smd 2.6 x 2.4: + -3.2,0; - 3.2,0
CT6032 = smd 2.6 x 2.2: + -2.5,0; - 2.5,0
SOD123 = smd 1.4 x 1.4: A 1.9,0; C -1.9,0
DO214AA = smd 1.8 x 2.2: A 2.55,0; C -2.55,0
SOD80C = smd 1.4 x 1.8: A 1.7,0; C -1.7,0
DO214AC = smd 1.8 x 1.7: A 2.05,0; C -2.05,0
R0603 = smd 1 x 1.1: 1 -0.85,0; 2 0.85,0
LITTLEFUSE = drill 0.813 pad 1.778 long: 1 -5.08,0; 2 5.08,0
TO252 = smd 1 x 1.6: 1 -2.28,-4.8; 2 2.28,-4.8 | smd 5.4 x 6.2: 3 0,2.5
SOIC127P600X175-8N = smd 2.184 x 0.559: 1 -2.362,1.905; 2 -2.362,0.635; 3 -2.362,-0.635; 4 -2.362,-1.905; 5 2.362,-1.905; 6 2.362,-0.635; 7 2.362,0.635; 8 2.362,1.905
62104021021 = smd 0.75 x 2.1: 1 -12.065,-1.95; 2 -10.795,-1.95; 3 -9.525,-1.95; 4 -8.255,-1.95; 5 -6.985,-1.95; 6 -5.715,-1.95; 7 -4.445,-1.95; 8 -3.175,-1.95; 9 -1.905,-1.95; 10 -0.635,-1.95; 11 0.635,-1.95; 12 1.905,-1.95; 13 3.175,-1.95; 14 4.445,-1.95; 15 5.715,-1.95; 16 6.985,-1.95; 17 8.255,-1.95; 18 9.525,-1.95; 19 10.795,-1.95; 20 12.065,-1.95; 21 12.065,1.95; 22 10.795,1.95; 23 9.525,1.95; 24 8.255,1.95; 25 6.985,1.95; 26 5.715,1.95; 27 4.445,1.95; 28 3.175,1.95; 29 1.905,1.95; 30 0.635,1.95; 31 -0.635,1.95; 32 -1.905,1.95; 33 -3.175,1.95; 34 -4.445,1.95; 35 -5.715,1.95; 36 -6.985,1.95; 37 -8.255,1.95; 38 -9.525,1.95; 39 -10.795,1.95; 40 -12.065,1.95
62101021021 = smd 0.75 x 2.1: 1 -1.905,-1.95; 2 -0.635,-1.95; 3 0.635,-1.95; 4 1.905,-1.95; 5 3.175,-1.95; 6 3.175,1.95; 7 1.905,1.95; 8 0.635,1.95; 9 -0.635,1.95; 10 -1.905,1.95
61900611021 = drill 1 square: 1 -6.35,0 | drill 1: 2 -3.81,0; 3 -1.27,0; 4 1.27,0; 5 3.81,0; 6 6.35,0
DR1030 = smd 3.3 x 1.6: 1 0,4.45; 2 0,-4.45
MINI-FLAT-16 = smd 1 x 0.5: 1 -3.24,4.445; 2 -3.24,3.175; 3 -3.24,1.905; 4 -3.24,0.635; 5 -3.24,-0.635; 6 -3.24,-1.905; 7 -3.24,-3.175; 8 -3.24,-4.445; 9 3.24,-4.445; 10 3.24,-3.175; 11 3.24,-1.905; 12 3.24,-0.635; 13 3.24,0.635; 14 3.24,1.905; 15 3.24,3.175; 16 3.24,4.445
SOT23 = smd 1 x 1.4: 1 -0.95,-1.1; 2 0.95,-1.1; 3 0,1.1
E3SBXXXXXXXF09G11AE = smd 1.4 x 1.1: 1 -1.1,0.8; 2 1.1,0.8; 3 1.1,-0.8; 4 -1.1,-0.8
TC26H = drill 0.813: 1 -1.27,0; 2 1.27,0
SUPER-SOT3 = smd 1 x 1.4: 1 -0.95,-1.1; 2 0.95,-1.1; 3 0,1.1
HC49U = drill 0.7 pad 1.2: 1 -2.413,0; 2 -0.027,0; 3 2.413,0
R0805 = smd 1.3 x 1.5: 1 -0.85,0; 2 0.85,0
RELAY_PCJ = drill 0.5 square: 11 2.35,2.35; 14 9.35,2.35; A1 -9.15,2.35; A2 -9.15,-2.35
SOT95P275X110-5N = smd 1.321 x 0.457: 1 -1.27,0.94; 2 -1.27,0; 3 -1.27,-0.94; 4 1.27,-0.94; 5 1.27,0.94
SOP65P780X200-28N = smd 2.057 x 0.432: 1 -3.429,4.216; 2 -3.429,3.581; 3 -3.429,2.921; 4 -3.429,2.286; 5 -3.429,1.626; 6 -3.429,0.965; 7 -3.429,0.33; 8 -3.429,-0.33; 9 -3.429,-0.965; 10 -3.429,-1.626; 11 -3.429,-2.286; 12 -3.429,-2.921; 13 -3.429,-3.581; 14 -3.429,-4.216; 15 3.429,-4.216; 16 3.429,-3.581; 17 3.429,-2.921; 18 3.429,-2.286; 19 3.429,-1.626; 20 3.429,-0.965; 21 3.429,-0.33; 22 3.429,0.33; 23 3.429,0.965; 24 3.429,1.626; 25 3.429,2.286; 26 3.429,2.921; 27 3.429,3.581; 28 3.429,4.216
MULTICOMP-CH7410-2032LF = smd 3 x 2.6: GND -10.6,0 | smd 2.8 x 3.6: V+ 10.7,0
LQFP48 = smd 1.5 x 0.3: 1 -4.15,2.75; 2 -4.15,2.25; 3 -4.15,1.75; 4 -4.15,1.25; 5 -4.15,0.75; 6 -4.15,0.25; 7 -4.15,-0.25; 8 -4.15,-0.75; 9 -4.15,-1.25; 10 -4.15,-1.75; 11 -4.15,-2.25; 12 -4.15,-2.75; 25 4.15,-2.75; 26 4.15,-2.25; 27 4.15,-1.75; 28 4.15,-1.25; 29 4.15,-0.75; 30 4.15,-0.25; 31 4.15,0.25; 32 4.15,0.75; 33 4.15,1.25; 34 4.15,1.75; 35 4.15,2.25; 36 4.15,2.75 | smd 0.3 x 1.5: 13 -2.75,-4.15; 14 -2.25,-4.15; 15 -1.75,-4.15; 16 -1.25,-4.15; 17 -0.75,-4.15; 18 -0.25,-4.15; 19 0.25,-4.15; 20 0.75,-4.15; 21 1.25,-4.15; 22 1.75,-4.15; 23 2.25,-4.15; 24 2.75,-4.15; 37 2.75,4.15; 38 2.25,4.15; 39 1.75,4.15; 40 1.25,4.15; 41 0.75,4.15; 42 0.25,4.15; 43 -0.25,4.15; 44 -0.75,4.15; 45 -1.25,4.15; 46 -1.75,4.15; 47 -2.25,4.15; 48 -2.75,4.15
SOIC127P1034X264-18N = smd 1.981 x 0.559: 1 -4.699,5.08; 2 -4.699,3.81; 3 -4.699,2.54; 4 -4.699,1.27; 5 -4.699,0; 6 -4.699,-1.27; 7 -4.699,-2.54; 8 -4.699,-3.81; 9 -4.699,-5.08; 10 4.699,-5.08; 11 4.699,-3.81; 12 4.699,-2.54; 13 4.699,-1.27; 14 4.699,0; 15 4.699,1.27; 16 4.699,2.54; 17 4.699,3.81; 18 4.699,5.08
J1 = drill 0.9 pad 1.3: 1 4.445,2.54; 2 3.175,0; 3 1.905,2.54; 4 0.635,0; 5 -0.635,2.54; 6 -1.905,0; 7 -3.175,2.54; 8 -4.445,0 | drill 1 pad 1.422: 9 5.465,7.37; 10 2.925,7.37; 11 -2.925,7.37; 12 -5.465,7.37 | drill 1.6 pad 2.184: M1 -7.875,-3.3; M2 7.875,-3.3 | hole 3.3: 5.715,-6.35; -5.715,-6.35
MKDSN1,5/10-5,08 = drill 1.3 pad 2: 1 -22.881,0.025; 2 -17.801,0.025; 3 -12.721,0.025; 4 -7.641,0.025; 5 -2.561,0.025; 6 2.519,0.025; 7 7.599,0.025; 8 12.679,0.025; 9 17.759,0.025; 10 22.839,0.025

### Placement (x,y rotation side)
C1  146.4,58.2 270 top
C2  146.4,61.6 270 top
C3  47.4,28.5 180 top
C4  106.9,54 0 top
C5  104.7,49.8 180 top
C6  2,37 90 top
C7  148.9,58.2 270 top
C8  148.9,61.6 270 top
C9  133.6,58.2 270 top
C10  133.6,61.6 270 top
C11  136,58.2 270 top
C12  136.1,61.6 270 top
C13  149.8,18.1 270 top
C14  55.3,19.8 180 top
C15  40.8,20 0 top
C16  138.3,73.1 90 top
C17  150.7,72.9 90 top
C18  153.8,18.1 270 top
C19  50.5,54 0 top
C20  47.7,58.6 90 top
C21  49.3,46.5 0 top
C22  49.3,50.7 0 top
C23  35.6,55.9 180 top
C24  49.3,48.6 0 top
C25  58.5,51.1 90 top
C26  58.5,55.3 270 top
C27  123.8,51.7 0 top
C28  112,53 180 top
C29  120.1,41.9 270 top
C30  105.6,46.2 180 top
C31  29.5,66 270 top
C32  100n  [C0603]  43.3,58.5 270 top
C33  18.5,51.5 180 top
C34  27,42.2 90 top
C35  12.5,28.5 270 top
C36  10.3,35 90 top
C37  26,16 90 top
C38  18,15.5 180 top
D1  62.7,28.6 90 top
D2  54.8,26.2 270 top
D3  104,72.5 270 top
D4  101.5,72.5 90 top
D5  30.1,13.9 90 top
D6  98,72.5 270 top
D7  95,72.6 90 top
D8  91.5,72.5 270 top
D9  88.5,72.5 90 top
D10  85,72.5 270 top
D11  82,72.5 90 top
D12  78.5,72.5 270 top
D13  75.5,72.5 90 top
D14  72,72.5 270 top
D15  69,72.5 90 top
D16  65.5,72.5 270 top
D17  62.5,72.5 90 top
D18  59,72.5 270 top
D19  55.9,72.5 90 top
D20  72.5,28.6 90 top
D21  82.8,28.6 90 top
D22  92.9,28.6 90 top
D23  104.2,28.4 90 top
D24  115.5,28.5 90 top
D25  125.6,28.6 90 top
D26  135.6,28.7 90 top
D27  126.7,76.5 0 top
D28  123.4,76.5 180 top
D29  116.2,76.5 0 top
D30  112.9,76.5 180 top
D31  148.1,76.6 180 top
D32  152.5,76.6 0 top
D33  137.9,76.7 180 top
D34  142,76.7 0 top
F1  16.2,11 0 top
IC1  150.9,26.8 0 top
IC2  12.5,53.5 180 top
K1  20.3,76.2 0 top
K2  12.7,22.8 0 top
K4  30.5,22.8 180 top
K5  152.2,40.9 270 top
L1  47.3,34.7 90 top
OK1  92.5,64.5 270 top
OK2  69,64.5 270 top
Q1  66.6,33.5 90 top
Q2  11.5,32 180 top
Q3  104.2,52.6 90 top
Q4  76.5,33.4 90 top
Q5  86.8,33.6 90 top
Q6  96.7,33.3 90 top
Q7  108.6,34 90 top
Q8  119.6,34.4 90 top
Q9  129.2,34.3 90 top
Q10  139.5,34.1 90 top
Q12  15,48 0 top
QF1  55,53 90 top
R1  70.2,33.4 270 top
R2  108.8,48.5 180 top
R3  144,58.2 90 top
R4  144,61.6 90 top
R5  142.9,69.4 90 top
R6  142.9,65.2 90 top
R7  97.8,59 0 top
R8  103.5,76.5 180 top
R9  151.4,58.2 90 top
R10  151.4,61.6 90 top
R11  153.5,68 90 top
R12  37.9,61.5 90 top
R13  153.5,63.7 90 top
R14  131.1,58.2 90 top
R15  45.8,61.6 90 top
R16  38.8,44.1 270 top
R17  33.8,43.8 270 top
R18  32,66 270 top
R19  32,69.5 90 top
R20  40.8,61.5 90 top
R21  42.9,61.5 90 top
R22  131.1,61.6 90 top
R23  130.5,69.7 90 top
R24  116,59 270 top
R25  7.4,68.3 180 top
R26  7.4,65.8 180 top
R27  129.5,66.5 0 top
R28  138.4,58.2 90 top
R29  138.4,61.6 90 top
R30  140.5,68.1 90 top
R31  15,44.5 180 top
R34  27.4,38.8 180 top
R35  140.5,64 90 top
R36  3.5,40 270 top
R37  3.5,43 90 top
R38  8.5,28 90 top
R39  128.3,71.2 90 top
R40  125.8,71.2 270 top
R41  120.6,71.2 90 top
R42  123.1,71.2 270 top
R43  117.6,71.3 90 top
R44  115,71.3 270 top
R45  109.2,71.3 90 top
R46  112.2,71.3 270 top
R47  95.5,56.5 0 top
R48  97.5,76.5 180 top
R49  90,56.5 180 top
R50  91,76.5 180 top
R51  88.5,59 180 top
R52  84.5,76.5 180 top
R53  74.3,59 0 top
R54  78,76.5 180 top
R55  72.5,56.5 0 top
R56  71.5,76.5 180 top
R57  67.5,56.5 180 top
R58  65,76.5 180 top
R59  65,59 180 top
R60  58.5,76.5 180 top
R61  79.8,33.3 270 top
R62  90.2,33.5 270 top
R63  100,33.2 270 top
R64  112,33.9 270 top
R65  122.8,34.3 270 top
R66  132.6,34.2 270 top
R67  142.8,34 270 top
S1  67.4,21 270 top
S2  77.5,21 270 top
S3  87.7,21 270 top
S4  97.9,21 270 top
S5  110,21 270 top
S6  120.3,21 270 top
S7  130.4,21 270 top
S8  140.6,21 270 top
U1  47.3,24.8 0 top
U2  23,16 90 top
U3  147.9,68 0 top
U4  135.5,68.2 0 top
U5  42.2,51.3 0 top
U$1  82.6,45.6 0 top
U$2  117,48.5 0 top
U$3  20,35 0 top
U$4  5.5,34.5 270 top
X1  42.5,71.6 180 top
X2  25.9,4.2 0 top
X3  77.4,4.2 0 top
X4  130.3,4.2 0 top
X5  77.5,82.2 180 top
X6  129.8,82.3 180 top

### Tracks (layer width: path | path; a pad name or v marks a point on that pad's centre or on a via)
1-WIRE  (via drill 0.6)
  Top 0.406: IC2.2 13.63,52.87 13,52.23 13,50.13 13.63,49.5 15,49.5 Q12.3 15.86,49.1 v21,44
  Bottom 0.406: v21,44 35.5,29.5 35.5,12.5 43.66,4.34 X2.9
24VIN
  pour Top (isolate 0.61): 0.5,1 10.5,1 10.5,8 12.5,8 12.5,13.5 0.5,13.5
+3V3  (via drill 0.5, 0.6)
  Top 0.254: C27.1 123.05,51.25 U$2.36 | U$2.9 111.45,47.25 110.4,46.2 C30.1 106.45,48.25 107.8,48.4 R2.2 | C29.1 119.75,42.75 U$2.24 119.75,43.05 120.2,42.6 v121.4,42.6 | 114.25,52.8 U$2.48 | 64.6,53.8 64.2,53.4 | R17.2 33.8,41.8 36.3,40.3 | X1.3 40.96,69.06 42.2,70.2 44.7,70.2 45.7,71.1 45.7,72.3 46.4,73 47.5,73 48.2,72.3 48.2,66.4 49.5,65.1 58,65.1 60.8,62.3 60.8,56.1 64.1,52.85 | v46,41 46.6,41.06 46.6,41 | U5.25 48.79,53.59 | 46.99,46.99 46.92,47.08 | 48.26,46.99 C21.1
  Top 0.305: 64.2,53.4 64.2,53.3 64.35,53.15 | U5.25 48.86,53.59 C19.1 | X1.3 40.14,69.06 38.9,70.3 37,70.3 35.6,68.9 32.05,68.9 R19.1 | C22.1 48.26,50.4 U5.20 | C24.1 48.2,48.6 46.8,49.7 45.66,49.7 U5.19 | R25.2 6.11,68.34 2.96,68.34 | R26.2 3.1,65.8 | 114.25,52.8 113.05,52.8 C28.1
  Top 0.406: U1.4 38.4,22.89 38.3,21.3 | U5.15 46.92,47.08 47.5,46.5 C21.1 48.5,46.5 | R55.2 73.35,54.55 73.5,54.4 | C20.1 47.8,57.75 v47.8,56.5 46.72,55.52 U5.28 | C19.1 49.65,54.65 v50.2,55.2 | C31.1 R18.1 R19.1 | 17.65,51.59 C33.2 | R31.2 11.6,44.5 v8,48.1 | 27,40.08 v26.5,40.08 27,40.08 | 27,40.08 U$3.18 | C34.1 27,40.08 | R34.1 28.25,39.45 27.61,40.08 27,40.08
  Top 0.61: K5.1 149.55,47.25 148,45.7 148,37.6 | 148,37.6 148,34.7 v145.3,32 | R53.2 75.15,55.75 73.8,54.4 | R57.2 66.65,55.45 65.6,54.4 | R59.2 64.15,52.95 64.1,52.85 | R51.2 87.65,55.25 86.8,54.4 | R49.2 89.15,54.85 89.2,54.4 | 96.2,54.4 96.2,54.5 | 96.2,54.5 96.2,56.05 R47.2 | R7.2 98.65,56.95 96.2,54.5 | 107.8,48.4 105.3,48.4 | 105.3,48.4 v105.2,48.3 | 105.3,48.4 102,48.4 101.1,49.3 101.1,53.5 103.8,56.2 109.8,56.2 111.5,54.5 112.5,54.5 113,54 113,53.15 C28.1 | v128.6,51 126,53.6 123.7,53.6 122.9,52.8 122.9,51.65 C27.1 | v131.3,42.1 143.5,42.1 148,37.6 | IC2.1 17.65,51.59 | v20.2,49.8 17.65,49.8 C33.2
  Top 0.813: K1.1 8.23,72.53 2.96,68.34 3.1,68 | 48.2,41 48.45,41.3 C21.1 C24.1 C22.1
  Top 1.016: 96.2,54.4 89.2,54.4 86.8,54.4 73.8,54.4 73.5,54.4 65.6,54.4 64.35,53.15 64.1,52.85 64.1,41 48.2,41 46.6,41 v46,41 37.3,41 36.3,40.3 36.3,35.2
  Top 1.27: 3.1,68 3.1,65.8 3.1,52.7 v8,48.1
  Bottom 0.254: 145.3,26.7 145.1,26.5 | v121.4,42.6 121.4,27 121,26.9 | 46,41.06 v46,41
  Bottom 0.61: v145.3,32 145.3,26.7 | v105.2,48.3 105.2,43 110.4,37.8 110.4,27.2 110.2,27 | v128.6,51 128.6,44.8 v131.3,42.1 | 20.6,48.1 20.2,48.2 v20.2,49.8
  Bottom 0.813: v26.5,40.08 26.7,40 v37.8,29 | v47.8,56.5 47.8,54.7 | 47.8,54.7 47.8,41.76 47.1,41.06 46,41.06 | v50.2,55.2 48.3,55.2 47.8,54.7
  Bottom 1.27: v8,48.1 20.6,48.1 39.8,28.9
  other vias: 37.8,27.5 37.7,25.8 37.7,24.4
  pour Bottom (isolate 0.61, rank 2): 36.5,29.9 36.5,23.6 146,23.4 146,27.7 59.2,27.7 59.2,30.1 53.3,30.1
  pour Top (isolate 0.61, rank 2): 35.7,18.3 35.7,37 46.9,37 46.9,28.9 40.3,28.9 40.3,18.3
+5V  (via drill 0.6)
  Top 0.254: v2.5,34.5 2,35 C6.1
  Top 0.305: U2.5 20,17.27 | 20,17.27 3.23,17.27 v2.5,18 | v2.5,34.5 4,34.5 4.87,35.37 U$4.3 | C38.1 19.4,16.67 20,17.27
  Bottom 0.305: v2.5,18 v2.5,34.5
+12V  (via drill 0.5)
  Top 0.254: 150.26,72.05 C17.1 150.7,72.2 | C16.1 137.86,71.81 137.86,72.2
  Top 0.61: 153.78,22 154.6,23.4 v154.5,56.7 | U3.8 150.26,72.05 | 150.7,72.2 v148.8,72.2 | 137.86,71.81 U4.8 | 137.86,72.2 v136.4,72.2
  Top 1.016: C18.1 153.78,22 IC1.2
  Bottom 0.61: v154.5,56.7 154.4,56.7 154.4,66.3 v148.8,72.2 v136.4,72.2
ADC1
  Top 0.254: U$2.10 111.7,46.75 109.3,44.5 103.4,44.5 100,47.9 100,53.9 113.3,67.2 123.4,67.2 125.8,69.6 R40.2
  Top 0.61: R40.2 R39.1
ADC2
  Top 0.254: U$2.11 111.85,46.25 109.6,44 102.9,44 99.1,47.8 99.1,54 113,67.9 119.6,67.9 120.6,68.9 R41.1
  Top 0.61: R42.2 R41.1
ADC3
  Top 0.254: U$2.12 112.05,45.75 109.8,43.5 102.5,43.5 98.2,47.8 98.2,54.2 112.6,68.6 114,68.6 115,69.6 R44.2
  Top 0.61: R44.2 R43.1
ADC4
  Top 0.254: U$2.13 114.25,43.55 113.7,43 102,43 97.5,47.5 97.5,54.4 112.2,69.1 R46.2
  Top 0.61: R45.1 R46.2
AIN1
  Top 0.406: 127.28,76.77 D27.2
  Top 0.61: X6.6 127.28,76.77 | R39.2 128.3,75.75 D27.2
AIN2
  Top 0.406: 121.9,76.5 D28.2 122.2,76.85
  Top 0.61: R41.2 120.6,75.2 121.9,76.5 | X6.7 122.2,76.85
AIN3
  Top 0.406: 117.12,76.57 D29.2
  Top 0.61: X6.8 117.12,76.57 | R43.2 117.6,75.95 D29.2
AIN4
  Top 0.406: 112.1,76.5 D30.2
  Top 0.61: R45.2 109.2,75 110.7,76.5 D30.2 | X6.9 D30.2
AOUT1
  Top 0.254: 153.41,68.64 R11.2 | 153.4,76.35 D32.2
  Top 0.61: U3.7 153.41,68.64 | R11.2 153.4,76.35 | D32.2 153.35,81.5 152.68,82.17 X6.1
AOUT2
  Top 0.254: 143.25,69.91 R5.2
  Top 0.61: X6.2 147.6,82.25 147.2,81.75 147.2,76.6 D31.2 147.25,75.15 146.1,73.9 144.4,73.9 142.9,72.4 R5.2 | U3.1 143.25,69.91
AOUT3
  Top 0.254: 142.52,76.77 D34.2 | 140.5,69.1 140.6,69 | 140.38,68.83 R30.2 140.97,68.58 140.97,72.39 141.18,72.18
  Top 0.61: X6.3 142.52,76.77 142.52,73.52 141.18,72.18 140.5,71.5 140.5,69.1 | U4.7 140.38,68.83
AOUT4
  Top 0.254: 131,70.11 130.6,70.5 | 130.7,70.65 R23.2 130.81,71.12 132.08,69.85 U4.1
  Top 0.61: U4.1 131,70.11 | X6.4 137.04,81.79 D33.2 137.05,75.25 135,73.2 132.1,73.2 130.7,71.8 130.7,70.65
CAN_NRST
  Top 0.406: U$3.17 25.99,38.81 | 25.99,38.81 arc-90 26,38.8 | R34.2 26,38.8 | 26,38.8 arc-90 25.99,38.81
CAN_OSC1
  Top 0.254: U$3.8 Q2.1 12.5,31.2 C35.1
CAN_OSC2
  Top 0.254: U$3.7 13.8,32.46 13.8,33.52 13.16,34.15 C36.1 10.3,32.8 Q2.3
CAN_RX
  Top 0.305: U$4.4 3.6,39.15 R36.2
CANH  (via drill 0.6)
  Top 0.305: U$4.7 6.13,30.36 v6.5,30
  Bottom 0.305: v6.5,30 8,30 33.5,4.3 X2.7
CANL  (via drill 0.6)
  Top 0.305: U$4.6 4.87,29.14 v4.5,29
  Bottom 0.305: v4.5,29 8,29 28.42,8.58 X2.6
DI1
  Top 0.61: R8.2 102.65,77.85 100.38,80.12 X5.1
DI2
  Top 0.61: R48.2 96.65,77.85 95.3,79.2 X5.2
DI3
  Top 0.61: R50.2 90.15,82.1 X5.3
DI4
  Top 0.61: R52.2 83.65,78.15 85.14,79.64 X5.4
DI5
  Top 0.61: X5.6 74.98,80.52 77.15,78.35 R54.2
DI6
  Top 0.61: X5.7 69.9,79.6 70.65,78.85 R56.2
DI7
  Top 0.61: X5.8 64.82,79.32 64.15,78.65 R58.2
DI8
  Top 0.61: X5.9 59.74,80.24 57.65,78.15 R60.2
ETH_INT
  Top 0.305: K1.7 15.86,60.15 22.41,53.59 U5.4
ETH_NRST  (via drill 0.5, 0.6)
  Top 0.254: K1.8 17.12,61.27 | U5.10 38.74,49.7 37.3,49.7 34.5,47.1 v34.5,46.2 34.5,46 34,45.5 33.9,45.4 33.8,45.3 R17.1
  Top 0.305: 17.12,61.27 17.12,60.88 v23,55
  Bottom 0.254: 31.3,46.2 31.6,46.2 v34.5,46.2
  Bottom 0.305: v23,55 31.3,46.2 31.6,46.2
ETH_OSC1
  Top 0.305: C25.1 55.59,50.25 QF1.1 53.12,52.27 U5.23
ETH_OSC2
  Top 0.254: C26.1 58.05,56 58,56
  Top 0.305: 58,56 55.69,56 QF1.3 54.51,55.01 52.43,52.93 U5.24
GND  (via drill 0.6)
  Top 0.254: Q2.4 Q2.2
  Top 0.305: U5.11 40.41,49.01 40.5,48.1 | U5.22 51.97,51.63 53,51.1 | C23.2 34.75,54.95 37.18,54.88 U5.2 34.72,54.88 34.7,54.9 | 51.4,47.8 51.5,47.9 | 118.5,50.5 118.75,50.75 U$2.35 125.75,50.75 126,51 | U$2.8 114.25,47.75 114.5,47.5 | U$2.23 119.25,45.75 119,46 | U$2.47 114.75,51.25 115,51 | 44.01,49.01 v43.7,50.2
  Top 0.406: U5.18 44.01,49.01 | U5.21 44.03,50.97 44,51 | U1.6 48,24.16 48,21
  Top 0.61: R65.1 120.9,35.15 Q8.2
  Top 0.813: X4.9 X4.10
  other vias: 109.4,53.8 119,39.5 128.4,58.1 103.4,46.3 117.4,46 6.9,27.2 45.2,58.2 51.7,55.5 38,59.4 30.6,63.5 43.6,53.7 41.4,47.7 47,19.7 45.8,21.2 48.1,21.2 49.4,19.7 29,18 27.6,18 14.3,27.7 150.3,75.7 140,75 135,55.7 148,55.7 140.9,60.9 153.3,60.9 124.8,74.4 114.1,74.6 6.7,78.8 32.5,18 34.1,38.5 149.8,14.3 154,14.3 34.1,40.1 38.3,38.9 40,38.9 31,18 6.6,77.6 114.7,47.7 118.7,50.2 7.4,52.1 18.4,54.1 124.7,35.4 113.7,35.4 92.7,38.4 82.7,38.4 12.3,36.2 27,44.3 102.4,49.8
  pour Top (isolate 0.406, rank 5): -6,95.5 170,95.5 170,-19.5 -6,-19.5
  pour Bottom (isolate 0.406, rank 6): -11.5,-24 177.5,-24 177.5,102 -11.5,102
IN1  (via drill 0.5, 0.6)
  Top 0.254: U$2.14 114.75,43.25 114,42.5 100.3,42.5 v98.5,44.3
  Top 0.406: v95.5,59 R7.1 OK1.16
  Bottom 0.254: v95.5,59 95.5,47.3 v98.5,44.3
IN2  (via drill 0.5, 0.6)
  Top 0.254: U$2.15 115.25,42.85 114.4,42 98.8,42 v96.1,44.7
  Top 0.406: R47.1 94.41,56.5 94.41,58.5 | 94.41,58.5 OK1.14 | v93.5,58.5 94.41,58.5
  Bottom 0.254: v93.5,58.5 93.5,47.4 v96.1,44.7
IN3  (via drill 0.5, 0.6)
  Top 0.254: U$2.16 115.75,42.55 114.7,41.5 97.5,41.5 v96,43 | R49.1 90.85,56.4
  Top 0.406: OK1.12 91.86,57.41 R49.1 v92.5,56.5
  Bottom 0.254: v92.5,56.5 92.5,46.5 v96,43
IN4  (via drill 0.5, 0.6)
  Top 0.254: U$2.17 116.25,42.35 114.9,41 96.1,41 v95.7,41.4
  Top 0.406: v90.6,59 R51.1 89.33,59 OK1.10
  Bottom 0.254: v90.6,59 90.6,46.6 v95.7,41.4
IN5  (via drill 0.5, 0.6)
  Top 0.254: U$2.21 118.25,41.25 116,39 100.5,39 v98.3,36.8 | 73.44,59.51 R53.1
  Top 0.406: OK2.16 73.44,59.51 | v72.1,59 R53.1
  Bottom 0.254: v98.3,36.8 74.1,36.8 72.1,38.8 v72.1,59
IN6  (via drill 0.5, 0.6)
  Top 0.254: U$2.22 118.75,40.95 116.3,38.5 103.3,38.5 v100.4,35.6
  Top 0.406: OK2.14 70.91,57.09 71.5,56.5 | v70.2,56 71,56 71.5,56.5 | R55.1 71.5,56.5
  Bottom 0.254: v100.4,35.6 72.41,35.51 70.2,37.81 v70.2,56
IN7  (via drill 0.5, 0.6)
  Top 0.254: U$2.25 121.85,45.75 122.3,45.3 122.3,41.1 119.2,38 105.9,38 v102.3,34.4
  Top 0.406: OK2.12 68.36,59.59 68.36,58.9 | 68.36,58.9 R57.1 | v69.3,58.5 68.5,58.5 68.36,58.64 68.36,58.9
  Bottom 0.254: v102.3,34.4 71.31,34.21 69.3,36.21 v69.3,58.5
IN8  (via drill 0.5, 0.6)
  Top 0.254: U$2.26 122.15,46.25 122.9,45.5 122.9,40.8 119.4,37.4 109.3,37.4 v108.8,37
  Top 0.406: OK2.10 65.83,59.52 R59.1 v67.1,59
  Bottom 0.254: v108.8,37 107.8,37 103.9,33.1 70.4,33.1 67.1,36.5 v67.1,59
LEDA
  Top 0.305: X1.9 36.3,63.59 36.3,59.6 37.5,58.4 40.8,58.4 42.6,56.5 42.6,55 42.72,54.88 U5.27
LEDB
  Top 0.406: U5.26 47.22,54.22 49.5,56.5 49.5,62.5 47.97,64.03 X1.12
N$1
  Top 0.406: U1.1 43.1,26.7 43.1,28.4 46,28.4 C3.2
N$2
  Top 0.406: IC2.6 11.37,54.13 12,53.5 12,47.63 12.63,47 14,47 14,46.95 Q12.1
N$3  (via drill 0.5)
  Top 0.254: U$2.1 108.6,51.25 108.6,51.65 v108.55,51.65 | v96.5,50 96.5,48.8 U$1.V+
  Bottom 0.254: v108.55,51.65 107.5,52.6 98.2,52.6 96.5,51 v96.5,50
N$4
  Top 1.016: D1.A arc-90 62.85,30.25 S1.A2 65.05,33.5 Q1.3
N$5
  Top 0.61: C7.1 R9.2 R10.1
N$6
  Top 0.61: R4.1 R3.2 C1.1
N$7
  Top 0.254: R4.2 C2.1 146.4,63.9 147.8,65.3 147.8,66.9 147.34,67.36 U3.3
N$8
  Top 0.61: R8.1 104.35,74.55 D3.C
N$9
  Top 0.254: 142.99,68.64 R5.1
  Top 0.61: U3.2 142.99,68.64 | R5.1 R6.2
N$10
  Top 0.406: OK1.1 96.94,68.44 97.5,69 100.4,69 102,70.6
  Top 0.61: D4.C 102,70.6 103.8,70.6 D3.A
N$11
  Top 0.254: R10.2 C8.1 148.85,62.5 151.1,62.5 151.8,63.2 151.8,65.1 151.4,65.5 150.26,65.5 U3.5
N$12
  Top 1.016: Q8.3 117.95,34.45 S6.A2 117.7,30.4 D24.A
N$13
  Top 0.254: R22.1 R14.2 C9.1
N$14
  Top 0.254: R22.2 C10.1 133.6,63.7 134.1,64.2 134.4,64.2 135.3,65.1 135.3,66.6 134.34,67.56 U4.3
N$15
  Top 0.254: 130.62,68.83 R23.1
  Top 0.61: U4.2 130.62,68.83 | R23.1 130.5,66.65 R27.2
N$16
  pour Top (isolate 0.61, rank 2): 47.8,24.8 47.8,37.1 56.2,37.1 56.2,24.8
N$17
  Top 0.254: R29.1 R28.2 | R28.2 138.4,59 138.3,59 138.2,58.9 | C11.1 R28.2
N$18
  Top 0.254: 136.05,62.4 C12.1 R29.2 138.4,66.3 U4.5
N$19
  Top 0.406: Q12.2 15.95,44.6 R31.1
N$20
  Top 0.305: U$3.1 9.58,40.08 7.41,37.91 U$4.1
N$21
  Top 0.61: R48.1 98.35,74.55 D6.C
N$22  (via drill 0.6)
  Top 0.254: 3.5,41 R36.1
  Top 0.305: U$3.2 11.19,38.81 v11,38.5 | v8.5,41 3.5,41 | R37.1 3.5,41 | 3.5,41 R36.1
  Bottom 0.305: v11,38.5 v8.5,41
N$23
  Top 0.406: OK1.3 94.41,68.91 95,69.5 D7.C
  Top 0.61: D7.C 97.9,70.7 D6.A
N$24
  Top 0.305: U$4.8 7.41,30.59 8.5,29.5 R38.2
N$26
  Top 0.254: C32.1 42.9,59.35 42.9,59.4
  Top 0.305: R20.1 R21.1 42.9,59.4
N$28
  Top 0.305: U5.1 36.83,55.52 C23.1
N$29
  Top 0.406: R12.2 37.9,62.9 39.23,64.23 X1.10
N$30
  Top 0.305: X1.11 45.8,64.16 R15.2
N$32
  Top 0.61: R13.2 R11.1 153.28,67.36 U3.6
N$33
  Top 0.254: R30.1 140.19,67.56
  Top 0.61: 140.19,67.56 U4.6 | R30.1 R35.2
N$38
  Top 0.61: R50.1 91.85,74.55 D8.C
N$39
  Top 0.406: 91.86,71.14 D8.A 91.5,69.5 91.86,69.14 OK1.5
  Top 0.61: D9.C 91.3,70.6 D8.A
N$40
  Top 0.61: R52.1 85.35,74.55 D10.C
N$41
  Top 0.406: OK1.7 89.33,68.67 89,69 86.8,69 D10.A
  Top 0.61: D11.C 84.8,70.6 D10.A
N$42
  Top 0.61: R54.1 78.85,74.55 D12.C
N$43
  Top 0.305: U5.14 38.77,44.98 R16.1
N$45
  Top 0.406: OK2.1 73.44,68.44 75.5,70.5 D13.C
  Top 0.61: D13.C 78.3,70.6 D12.A
N$47
  Top 0.61: R56.1 72.35,74.55 D14.C
N$49
  Top 0.406: 72.1,70.7 D14.A 72,69.5 70.91,68.41 OK2.3
  Top 0.61: D15.C 71.8,70.6 D14.A
N$51
  Top 0.61: R58.1 65.85,74.55 D16.C
N$53
  Top 0.406: D16.A 66.3,70.7 68.36,68.64 OK2.5
  Top 0.61: D17.C 65.3,70.6 D16.A
N$54
  Top 0.61: R60.1 59.35,74.55 D18.C
N$55
  Top 0.406: OK2.7 65.83,68.67 65.5,69 60.8,69 D18.A
  Top 0.61: D19.C 58.8,70.6 D18.A
N$56
  Top 0.254: D20.A 72.39,30.48 72.55,30.15
  Top 1.016: 72.55,30.15 S2.A2 75.15,33.35 arc90 Q4.3
N$57
  Top 0.254: D21.A 82.55,30.48 82.95,30.25
  Top 1.016: 82.95,30.25 S3.A2 85.35,33.65 Q5.3
N$58
  Top 0.254: D22.A 92.71,30.48 93.98,30.48 93.98,30.15
  Top 1.016: 93.55,30.15 93.98,30.15 S4.A2 95.55,33.25 Q6.3
N$59
  Top 0.254: D23.A 104.14,30.48 104.2,30.15
  Top 1.016: 104.2,30.15 S5.A2 107.5,30.65 Q7.3
N$61
  Top 1.016: D25.A 125.75,30.15 S7.A2 128.15,34.25 Q9.3
N$62
  Top 1.016: D26.A 135.65,30.15 S8.A2 138.25,33.85 Q10.3
OSCI
  Top 0.254: C4.1 104.33,54 Q3.2 104.27,53.9 104.4,53.9 107.5,50.7 111.5,50.7 111.95,50.25 U$2.3
OSCO
  Top 0.254: U$2.4 111.55,49.75 111.2,50.1 107.3,50.1 106.1,51.3 106.07,51.33 105.5,51.33 | Q3.1 105.5,51.33 | C5.1 105.55,51.28 105.5,51.33
OUT1
  Top 0.254: U$2.18 116.75,42.05 115.2,40.5 97.8,40.5 97.7,40.4 80.1,40.4 72,32.5 70.25,32.5 R1.2
  Top 0.813: Q1.1 R1.2
OUT2
  Top 0.254: U$2.19 117.25,41.85 115.4,40 98.1,40 97.9,39.8 89.2,39.8 81.9,32.5 79.85,32.5 R61.2
  Top 0.813: Q4.1 R61.2
OUT3
  Top 0.254: U$2.20 117.75,41.55 115.7,39.5 98.4,39.5 91.6,32.6 90.3,32.6
  Top 0.305: 90.5,32.5 90.35,32.65 R62.2 90.25,32.6 90.3,32.6
  Top 0.813: Q5.1 R62.2
OUT4  (via drill 0.5)
  Top 0.254: U$2.39 118.75,54.2 v119.4,54.8 | v124.8,40.3 121.2,36.9 110.6,36.9 109.6,35.9 105.6,35.9 102.05,32.35 R63.2
  Top 0.813: Q6.1 R63.2
  Bottom 0.254: v124.8,40.3 124.8,42.3 125.3,42.8 125.3,48.9 v119.4,54.8
OUT5  (via drill 0.5)
  Top 0.254: R64.2 113.25,33.05 116.5,36.3 123,36.3 125.7,38.9 125.7,44.6 126.4,45.3 v126.4,46.5 | v120.4,55.7 119.1,55.7 118.25,54.85 U$2.40
  Top 0.813: Q7.1 R64.2
  Bottom 0.254: v126.4,46.5 126.4,49.8 v120.4,55.7
OUT6  (via drill 0.5)
  Top 0.254: Q8.1 125.15,33.45 127.3,35.6 v127.3,44.4 | U$2.41 117.75,55.25 118.5,56 119.2,56.7 v122.1,56.7
  Top 0.813: Q8.1 R65.2
  Bottom 0.254: v127.3,44.4 127.3,51.3 v122.1,56.7
OUT7  (via drill 0.5)
  Top 0.254: Q9.1 134.05,33.35 135.3,34.6 v135.3,40.4 | U$2.42 117.25,55.55 117.9,56.2 119.3,57.6 v123.3,57.6
  Top 0.813: Q9.1 R66.2
  Bottom 0.254: v123.3,57.6 130.6,50.4 130.7,44.6 134.9,40.4 v135.3,40.4
OUT8  (via drill 0.5)
  Top 0.254: Q10.1 144.45,33.15 146.2,34.9 146.2,37.1 144.8,38.5 v142.3,38.5 | U$2.43 116.75,55.85 119.4,58.5 123.5,58.5 v124.4,58.5
  Top 0.813: Q10.1 R67.2
  Bottom 0.254: v124.4,58.5 131.6,51.3 131.6,46.9 140,38.5 v142.3,38.5
PWM1
  Top 0.254: U$2.29 144.55,47.75 151.4,54.6 R9.1
PWM2
  Top 0.254: U$2.30 143.85,48.25 146.5,50.9 146.5,54.85 R3.1
PWM3
  Top 0.254: U$2.31 133.85,48.75 138.4,53.3 R28.1
PWM4
  Top 0.254: U$2.32 133.55,49.25 134.5,50.2 134.5,53.95 R14.1
RELAY1_11
  Top 2: S1.11 64.68,13.58 X3.3
RELAY1_14
  Top 1.016: S1.14
  Top 2: S1.14 X3.4
RELAY2_11
  Top 2: S2.11 74.84,13.64 X3.5
RELAY2_14
  Top 1.016: S2.14 79.92,11.58
  Top 2: 79.92,11.58 X3.6
RELAY3_11
  Top 2: S3.11 85,13.6 X3.7
RELAY3_14
  Top 1.016: S3.14 90.08,11.62
  Top 2: 90.08,11.62 X3.8
RELAY4_11
  Top 2: S4.11 95.16,13.56 X3.9
RELAY4_14
  Top 2: S4.14 100.25,5.24 arc-1 X3.10
RELAY5_11
  Top 2: S5.11 107.4,13.7 107.4,4.9 arc3 X4.1
RELAY5_14
  Top 1.27: S5.14 112.5,11.6
  Top 2: 112.5,11.6 X4.2
RELAY6_11
  Top 2: S6.11 117.68,13.98 X4.3
RELAY6_14
  Top 1.27: S6.14
  Top 2: S6.14 X4.4
RELAY7_11
  Top 2: S7.11 127.74,13.74 X4.5
RELAY7_14
  Top 1.27: S7.14 132.82,11.62
  Top 2: 132.82,11.62 X4.6
RELAY8_11
  Top 2: S8.11 137.9,13.6 X4.7
RELAY8_14
  Top 1.27: S8.14 142.98,11.58
  Top 2: 142.98,11.58 X4.8
SCL  (via drill 0.5, 0.6)
  Top 0.254: U$2.45 115.75,55.75 114.2,57.3 v113.5,57.3 | K1.3 10.78,67.97 v10.7,67.8
  Top 0.305: v10.7,67.8 10.2,68.3 R25.1
  Top 0.406: IC2.4 13.1,55.41 12.5,56 v12.5,62.5
  Bottom 0.254: v113.5,57.3 103.2,67.2 11.4,67.2 v10.7,67.8
  Bottom 0.406: v12.5,62.5 11.5,62.5 10,64 10,67.1 v10.7,67.8
SDA  (via drill 0.5, 0.6)
  Top 0.254: U$2.46 115.25,55.45 114.7,56 v112,56 | K1.4 12.04,66.64 v11.3,65.9 11.3,65.8 8,62.5 8,56 8.5,55.5 8.6,55.41 IC2.5
  Top 0.305: R26.1 8.35,65.9 v11.3,65.9
  Bottom 0.254: v112,56 100.5,66.6 11.8,66.6 11.2,66 v11.3,65.9
SOM_NRST  (via drill 0.6)
  Top 0.305: K1.2 v9.5,70 | v124.3,45.3 124.3,47 124.05,47.25 U$2.28
  Top 0.406: K1.2
  Bottom 0.305: v9.5,70 12,70 14,67.8 104.5,67.8 124.3,48.7 v124.3,45.3
SPI2_CLK  (via drill 0.6)
  Top 0.305: U$3.13 25.77,33.73 v27.5,32 | v31,28.5 31.14,28.36 K4.2
  Bottom 0.305: v27.5,32 v31,28.5
SPI2_CS0
  Top 0.305: K4.1 32.41,33.59 28.46,37.54 U$3.16
SPI2_MISO
  Top 0.305: U$3.15 27.73,36.27 28.59,35.41 K4.4
SPI2_MOSI  (via drill 0.6)
  Top 0.305: U$3.14 26.5,35 v27.5,34 | K4.3 29.86,31.64 v29.5,32
  Bottom 0.305: v27.5,34 v29.5,32
SPI_CLK  (via drill 0.6)
  Top 0.254: 38.74,51 U5.8
  Top 0.305: K1.13 23.48,60.52 v29,55 | U5.8 33.97,50.97 v33.5,50.5
  Bottom 0.305: v29,55 v33.5,50.5
SPI_CS0  (via drill 0.6)
  Top 0.305: K1.14 24.75,61.26 v31,55 | U5.9 35.5,50.34 v35.5,50
  Bottom 0.305: v31,55 35.5,50.5 v35.5,50
SPI_MISO  (via drill 0.6)
  Top 0.305: K1.12 22.2,59.8 v27,55 | U5.6 29.73,52.27 v29.4,52.6
  Bottom 0.305: v27,55 v29.4,52.6
SPI_MOSI  (via drill 0.6)
  Top 0.305: K1.11 20.93,59.06 v25,55 | U5.7 29.37,51.63 v28.8,51.2
  Bottom 0.305: v25,55 v28.8,51.2
SWCLK  (via drill 0.5)
  Top 0.254: U$2.37 119.75,53.55 120.7,54.5 129.9,54.5 v131,54.6
  Bottom 0.254: v131,54.6 138.5,54.6 148.39,44.71 K5.2
SWDIO  (via drill 0.5)
  Top 0.254: U$2.34 122.25,50.25 122.5,50 133,50 133.05,50.25 v133.1,50.3
  Bottom 0.254: v133.1,50.3 140.2,50.3 151,39.7 152.13,39.7 K5.4
TPIN+  (via drill 0.5)
  Top 0.305: X1.7 45.67,69.08 40.8,64 R20.2 39.75,62.35 39.4,62 v39.4,59.6 | v36.9,45.2 36.9,47.2 37.4,47.7 38.79,47.7 U5.13
  Bottom 0.305: v39.4,59.6 39.4,47.7 v36.9,45.2
TPIN-  (via drill 0.5)
  Top 0.305: X1.8 46.95,68.14 42.9,64.1 R21.2 43.85,62.35 44.4,61.7 44.4,60.5 v44.3,60.5 | v35.4,45.3 36.2,46.1 36.2,47.4 37.2,48.4 38.75,48.4 U5.12
  Bottom 0.305: v44.3,60.5 41.9,60.5 40.2,58.8 40.2,46.8 36.7,43.3 35.9,43.3 34.9,44.3 34.9,44.8 v35.4,45.3
TPOUT+
  Top 0.305: X1.1 37.45,69.06 34,65.4 | 34,65.4 32.05,65.4 R18.2 | 34,65.4 34.9,64.5 34.9,59.9 37,57.8 40.3,57.8 41.9,56.1 41.9,49.9 43.4,48.4 45.61,48.4 U5.17
TPOUT-
  Top 0.305: R19.2 33.05,71.6 X1.2 31,71.6 28.3,69 28.3,63.4 35.3,57 40.1,57 41.1,56 41.1,49.8 43.2,47.7 45.61,47.7 U5.16
UC_BOOT
  Top 0.254: U$2.44 116.25,56.05 116.25,58.15 R24.2
UC_INT  (via drill 0.5, 0.6)
  Top 0.254: U$2.27 122.85,46.75 v123.3,46.3 | K1.5 13.31,65.31 v12.9,64.9
  Bottom 0.254: v123.3,46.3 122.9,46.7 120.4,46.7 99.7,66 13.6,66 12.9,65.2 v12.9,64.9
UC_NRST  (via drill 0.5, 0.6)
  Top 0.254: U$2.7 109.85,48.25 | 109.85,48.25 109.65,48.25 R2.1 109.85,48.25 | 109.85,48.25 109.9,49 v111,49 | K1.6 14.6,66.64 v14.6,64.9
  Bottom 0.254: 116.7,49 98.8,65.4 15.1,65.4 v14.6,64.9 | K5.5 123.81,37.09 123.6,37.3 123.6,42.1 116.7,49 | 116.7,49 v111,49
VCC
  Top 0.254: U2.3 24.07,14.6 C37.1
  Top 0.305: C37.1 26,12.5 22.5,12.5 22.06,12.94 U2.1
  Top 0.61: U1.7 59.47,25.43
  Top 1.016: S3.A1 90.05,26.75 arc-90 90.3,26.7 | S4.A1 100.25,26.85 arc-90 100.2,26.8 | S5.A1 112.35,27.05 arc-90 112.2,26.9 | S6.A1 122.65,27.15 arc-90 123,26.8 | S7.A1 132.75,27.05 arc90 133.2,26.9 | S8.A1 142.95,26.75 arc-90 143.1,26.7 | S1.A1 69.75,27.05 | S2.A1 79.85,26.65 | 142.9,24.4 146.4,24.5 IC1.1 149.8,22 C13.1
  Top 1.422: 59.47,25.43 59.4,16.5
  pour Top (isolate 0.61): 57,27.5 146.5,27.5 146.5,23.5 57,23.5
  pour Top (isolate 0.406): 19,13 57,13 57,23.7 60.5,23.7 60.5,9 19,9

### Text on the board
tDocu: Licensed under CERN v1.2 | ARGE guh | guhPLC | Author Bernhard Trinnes | bernhard.trinnes@guh.guru